# Altium project ek-ra8d2_mp - Customer.PrjPcb (part 1 of 5)
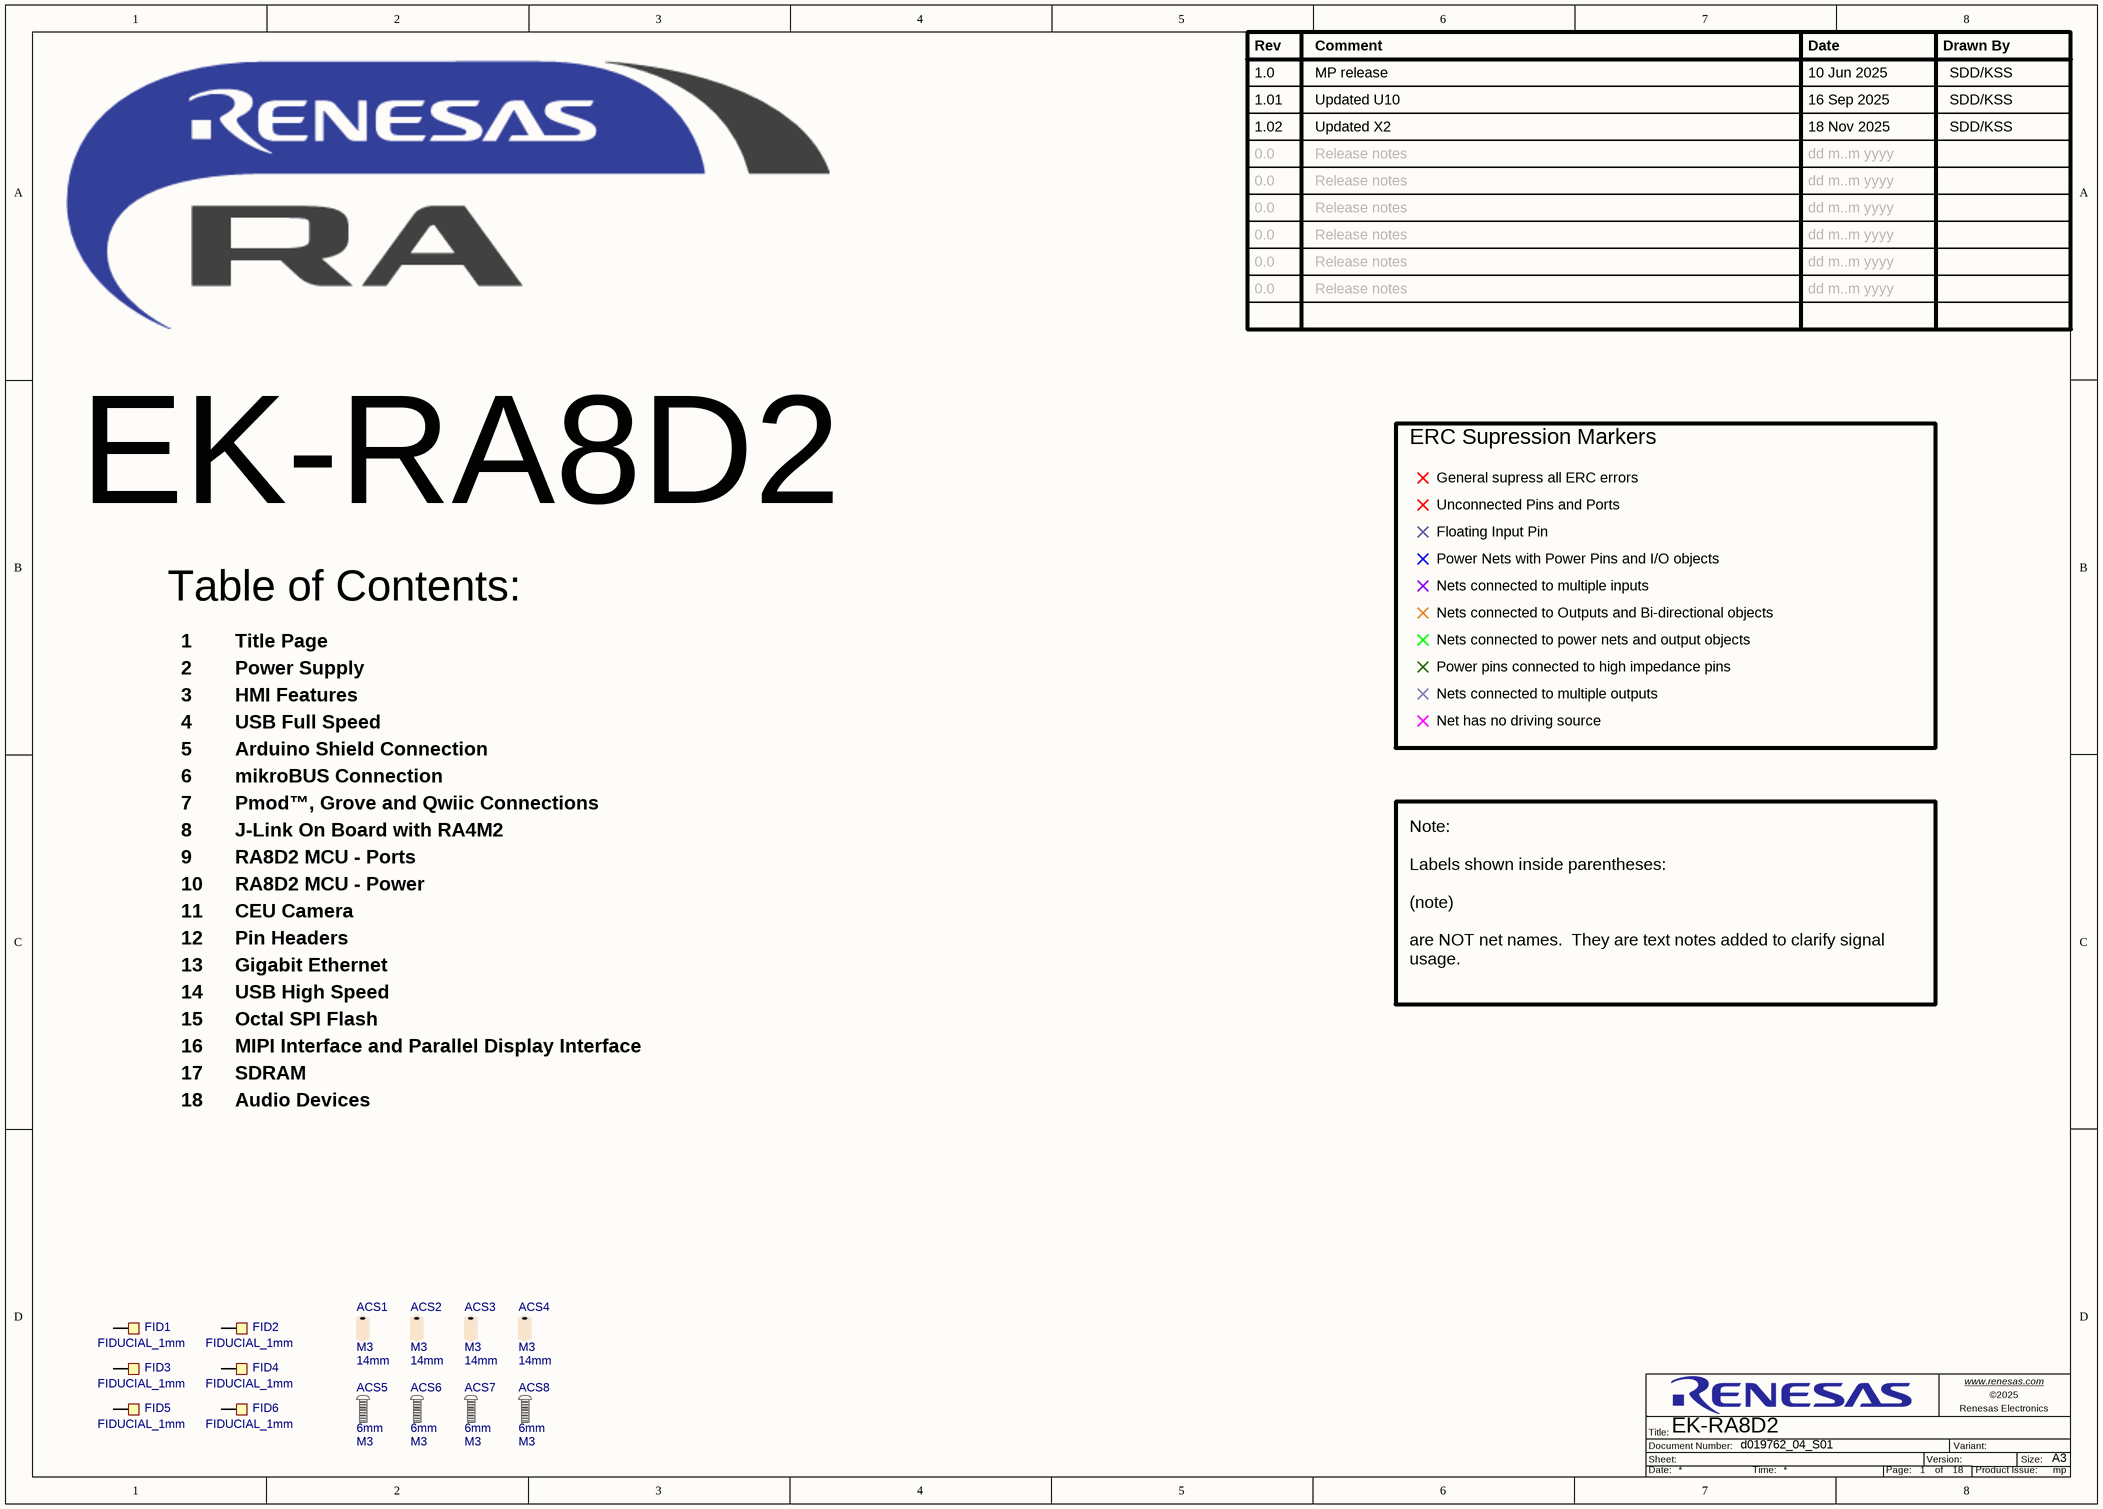
[diagram p0: Title Page.SchDoc]
Version: 0101; VariantNumber: 0; ReleaseState: mp; ReleaseDate: 16.09.2025; ProductName: EK-RA8D2; PCBARevision: 0100; Kitversion: 1; KitReleaseStage: mp; KitNameTop: EK RA8D2; KitName: EK-RA8D2; DNumberBase: d019762; DNumber: d019762; Date: 2025; .KitNameBottom: EK-RA8D2
18 sheets, 539 parts. Net scope: global (net labels, ports and power ports of the same name join across sheets).
Board file: ek_ra8d2.PcbDoc
Sheets:
  Title Page.SchDoc
  Power Supply.SchDoc
  HMI Features.SchDoc
  USB Full Speed.SchDoc
  Arduino Shield Connection.SchDoc
  mikroBUS Connection.SchDoc
  Pmod, Grove and Qwiic Connections.SchDoc
  J-Link On Board with RA4M2.SchDoc
  RA8D2 MCU - Ports.SchDoc
  RA8D2 MCU - Power.SchDoc
  CEU Camera.SchDoc
  Pin Headers.SchDoc
  Gigabit Ethernet.SchDoc
  USB High Speed.SchDoc
  Octal SPI Flash.SchDoc
  MIPI Interface and Parallel Display Interface.SchDoc
  SDRAM.SchDoc
  Audio Devices.SchDoc

## Sheet Title Page.SchDoc
size A3; Company Name: Renesas Electronics America; CompanyURL: www.renesas.com; PageSetup: Record=PageOptions|CenterHorizontal=True|CenterVertical=True|PrintScale=1.00|XCorrection=1.00|YCorrection=1.00|PrintKind=1|BorderSize=5000000|LeftOffset=0|BottomOffset=0|Orientation=2|PaperLength=1000|PaperWidth=1000|Scale=100|PaperSource=7|PrintQuality=-4|MediaType=1|DitherType=10|PaperKind=A5 148x210mm|PrintScaleMode=1; ReleaseDate: 16.09.2025; Version: MP; SheetNumber: 1; SheetTotal: 18; VariantNumber: 0; DSheetNumber: 1

### Parts
ACS1  Thread: M3  Length: 14mm  [standoff_6p0_M3x14x0p5_HexFemale]  (hidden comment: MTS-14)
ACS2  Thread: M3  Length: 14mm  [standoff_6p0_M3x14x0p5_HexFemale]  (hidden comment: MTS-14)
ACS3  Thread: M3  Length: 14mm  [standoff_6p0_M3x14x0p5_HexFemale]  (hidden comment: MTS-14)
ACS4  Thread: M3  Length: 14mm  [standoff_6p0_M3x14x0p5_HexFemale]  (hidden comment: MTS-14)
ACS5  Length: 6mm  Thread: M3  [screw_M3x0p5,6mm]  (hidden comment: 50M030050P006)
ACS6  Length: 6mm  Thread: M3  [screw_M3x0p5,6mm]  (hidden comment: 50M030050P006)
ACS7  Length: 6mm  Thread: M3  [screw_M3x0p5,6mm]  (hidden comment: 50M030050P006)
ACS8  Length: 6mm  Thread: M3  [screw_M3x0p5,6mm]  (hidden comment: 50M030050P006)
FID1  FIDUCIAL_1mm  [Fiducial_1mm]  (no BOM)
FID2  FIDUCIAL_1mm  [Fiducial_1mm]  (no BOM)
FID3  FIDUCIAL_1mm  [Fiducial_1mm]  (no BOM)
FID4  FIDUCIAL_1mm  [Fiducial_1mm]  (no BOM)
FID5  FIDUCIAL_1mm  [Fiducial_1mm]  (no BOM)
FID6  FIDUCIAL_1mm  [Fiducial_1mm]  (no BOM)

### Nets

Not connected (* = marked no-connect by the designer): FID1 1; FID2 1; FID3 1; FID4 1; FID5 1; FID6 1

### Notes on the sheet
- Rev
- Comment
- Date
- Drawn By
- 1.0
- 1.01
- MP release
- Updated U10
- 10 Jun 2025
- 16 Sep 2025
- SDD/KSS
- 0.0
- 1.02
- Release notes
- Updated X2
- dd m..m yyyy
- 18 Nov 2025
- ERC Supression Markers
- General supress all ERC errors
- Unconnected Pins and Ports
- Table of Contents:
- Floating Input Pin
- Power Nets with Power Pins and I/O objects
- Nets connected to multiple inputs
- 1
- Title Page
- Nets connected to Outputs and Bi-directional objects
- Nets connected to power nets and output objects
- 2
- 3
- Power Supply
- HMI Features
- Power pins connected to high impedance pins
- Nets connected to multiple outputs
- Net has no driving source
- 4
- 5
- 6
- USB Full Speed
- Arduino Shield Connection
- mikroBUS Connection
- 7
- 8
- Pmod™, Grove and Qwiic Connections
- J-Link On Board with RA4M2
- 9
- 10
- 11
- RA8D2 MCU - Ports
- RA8D2 MCU - Power
- CEU Camera
- 12
- 13
- Pin Headers
- Gigabit Ethernet
- 14
- 15
- 16
- USB High Speed
- Octal SPI Flash
- MIPI Interface and Parallel Display Interface
- Note:
  Labels shown inside parentheses:
  (note)
  are NOT net names.  They are text notes added to clarify signal usage.
- 17
- 18
- SDRAM
- Audio Devices
- www.renesas.com <http://www.renesas.com>
- Sheet:
- Title:
- Document Number:
- Version:
- Variant:
- Renesas Electronics
- Size:
- A3
- Date:
- Time:
- Page:
- of
- Product Issue:

### Library data of the parts
ACS1-ACS4 = ACS-00000000-5: Female Standoff; Nylon; Natural; M3; 14.0 mm Spacer; Width: 6mm; Subtype: Spacer; Material: Nylon Black
ACS5-ACS8 = ACS-00000005-4: Pan Phillips Screw, M3x0p5, Length 6mm, Natural, Nylon; Subtype: Screw; Material: Nylon Transparent
FID1-FID6 = MIS-00000006-3: Fiducial, 1mm, 0.5mm soldermask; Subtype: Testpoint; Value: TP; Qualification: -; Pin Count: 1

## Sheet Power Supply.SchDoc
size A3; Company Name: Renesas Electronics America; CompanyURL: www.renesas.com; PageSetup: Record=PageOptions|CenterHorizontal=True|CenterVertical=True|PrintScale=1.00|XCorrection=1.00|YCorrection=1.00|PrintKind=1|BorderSize=5000000|LeftOffset=0|BottomOffset=0|Orientation=2|PaperLength=1000|PaperWidth=1000|Scale=100|PaperSource=7|PrintQuality=-4|MediaType=1|DitherType=10|PaperKind=A5 148x210mm|PrintScaleMode=1; ReleaseDate: 16.09.2025; Version: MP; SheetNumber: 2; SheetTotal: 18; VariantNumber: 0; DSheetNumber: 1
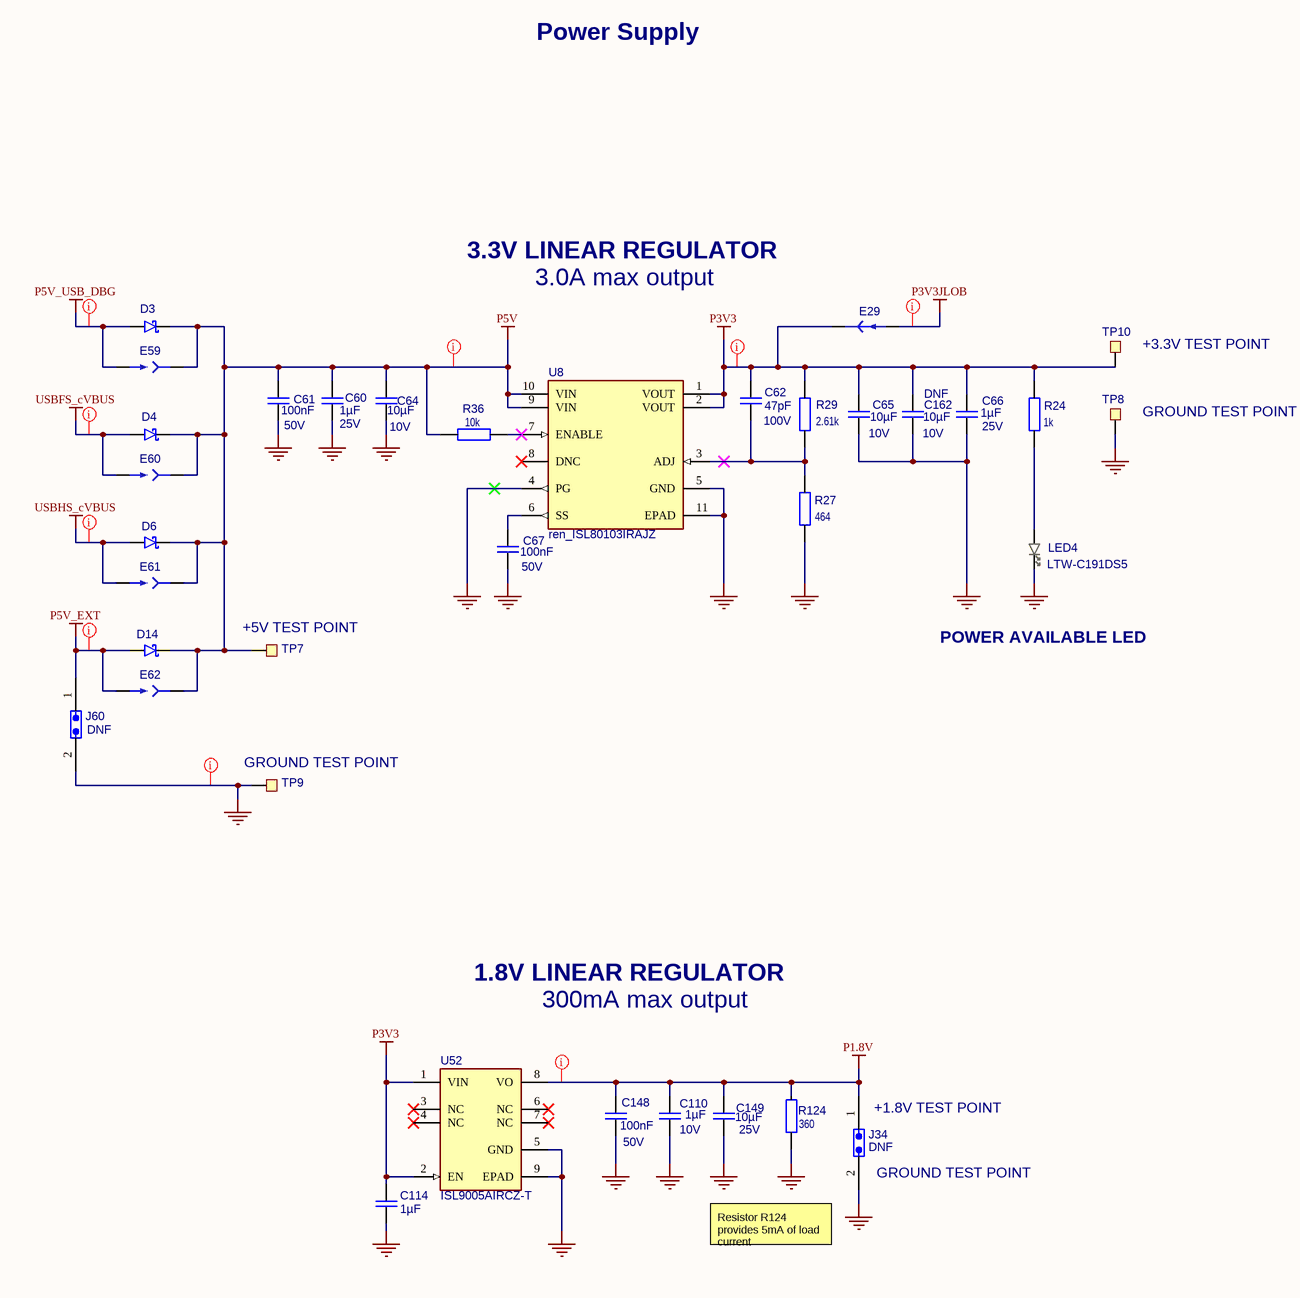
[diagram p1: Power Supply.SchDoc]

### Parts
C60  value 1µF  Operating Voltage Max: 25V  [C_EIA0402_0p6]  (hidden comment: Capacitor)
C61  value 100nF  Operating Voltage Max: 50V  [C_EIA0402_0p55]  (hidden comment: Capacitor)
C62  value 47pF  Operating Voltage Max: 100V  [C_EIA0402_0p55]  (hidden comment: Capacitor)
C64  value 10µF  Operating Voltage Max: 10V  [C_EIA0402_0p7]  (hidden comment: Capacitor)
C65  value 10µF  Operating Voltage Max: 10V  [C_EIA0402_0p7]  (hidden comment: Capacitor)
C66  value 1µF  Operating Voltage Max: 25V  [C_EIA0402_0p6]  (hidden comment: Capacitor)
C67  value 100nF  Operating Voltage Max: 50V  [C_EIA0402_0p55]  (hidden comment: Capacitor)
C110  value 1µF  Operating Voltage Max: 25V  [C_EIA0402_0p6]  (hidden comment: Capacitor)
C114  value 1µF  [C_EIA0402_0p6]  (hidden comment: Capacitor)
C148  value 100nF  Operating Voltage Max: 50V  [C_EIA0402_0p55]  (hidden comment: Capacitor)
C149  value 10µF  Operating Voltage Max: 10V  [C_EIA0402_0p7]  (hidden comment: Capacitor)
C162  value 10µF  Operating Voltage Max: 10V  [C_EIA0402_0p7]  (hidden comment: Capacitor)
D3  B340AQ-13-F  [dio_SMA]  (value not drawn)
D4  B340AQ-13-F  [dio_SMA]  (value not drawn)
D6  B340AQ-13-F  [dio_SMA]  (value not drawn)
D14  B340AQ-13-F  [dio_SMA]  (value not drawn)
E29  TRACE_CUT_0805  [trace_cut_0805]  (value not drawn)  (net tie, no BOM)
E59  SOLDER_BRIDGE_0805  [solder_bridge_0805]  (value not drawn)  (no BOM)
E60  SOLDER_BRIDGE_0805  [solder_bridge_0805]  (value not drawn)  (no BOM)
E61  SOLDER_BRIDGE_0805  [solder_bridge_0805]  (value not drawn)  (no BOM)
E62  SOLDER_BRIDGE_0805  [solder_bridge_0805]  (value not drawn)  (no BOM)
J34  61300211121  [wue_61300211121]  (value not drawn)
J60  61300211121  [wue_61300211121]  (value not drawn)
LED4  LTW-C191DS5  [led_0603_w]
R24  value 1k  [R_EIA0402]  (hidden comment: RC0402FR-071KL)
R27  value 464  [R_EIA0603]  (hidden comment: Resistor)
R29  value 2.61k  [R_EIA0603]  (hidden comment: Resistor)
R36  value 10k  [R_EIA0402]  (hidden comment: Resistor)
R124  value 360  [R_EIA0402]  (hidden comment: Resistor)
TP7  TP_Mini  [key_5019]  (value not drawn)
TP8  TP_Mini  [key_5019]  (value not drawn)
TP9  TP_Mini  [key_5019]  (value not drawn)
TP10  TP_Mini  [key_5019]  (value not drawn)
U8  ren_ISL80103IRAJZ  [ren_tdfn10_L10.3X3]
U52  ISL9005AIRCZ-T  [ren_DFN-8_3.00x2.00mm]

### Nets
GND: C60.2 C61.1 C64.1 C65.1 C66.2 C67.1 C110.2 C114.2 C148.1 C149.1 C162.1 J34.2 J60.2 LED4.1(K) R27.1 R124.1 TP8.1 TP9.1 U8.4(PG) U8.5(GND) U8.11(EPAD) U52.5(GND) U52.9(EPAD)
P1.8V: C110.1 C148.2 C149.2 J34.1 R124.2 U52.8(VO)
P3V3: C62.1 C65.2 C66.1 C114.1 C162.2 E29.1 R24.2 R29.2 TP10.1 U8.1(VOUT) U8.2(VOUT) U52.1(VIN) U52.2(EN)
P3V3JLOB: E29.2
P5V: C60.1 C61.2 C64.2 D3.1(K) D4.1(K) D6.1(K) D14.1(K) E59.1 E60.1 E61.1 E62.1 R36.1 TP7.1 U8.9(VIN) U8.10(VIN)
P5V_EXT: D14.2(A) E62.2 J60.1
P5V_USB_DBG: D3.2(A) E59.2
USBFS_cVBUS: D4.2(A) E60.2
USBHS_cVBUS: D6.2(A) E61.2
NetC62_2: C62.2 R27.2 R29.1 U8.3(ADJ)
NetC67_2: C67.2 U8.6(SS)
NetLED4_2: LED4.2(A) R24.1
NetR36_2: R36.2 U8.7(ENABLE)

Not connected (* = marked no-connect by the designer): U8 8(DNC)*; U52 3(NC)* 4(NC)* 6(NC)* 7(NC)*

### Layout directives
net class Power; rule Supply Nets [Voltage = 5.000]: P5V, P5V_EXT, P5V_USB_DBG, USBFS_cVBUS, USBHS_cVBUS
net class Power; rule Supply Nets [Voltage = 3.300]: P3V3, P3V3JLOB
net class Power; rule Supply Nets [Voltage = 1.800]: P1.8V
net class Power; rule Supply Nets [Voltage = 0.000]: GND

### Notes on the sheet
- Power Supply
- 3.0A max output
- 3.3V LINEAR REGULATOR
- (near TP10) +3.3V TEST POINT
- (near TP8) GROUND TEST POINT
- (near TP7) +5V TEST POINT
- POWER AVAILABLE LED
- (near TP9) GROUND TEST POINT
- 300mA max output
- 1.8V LINEAR REGULATOR
- (near J34) +1.8V TEST POINT
- (near J34) GROUND TEST POINT
- Resistor R124 provides 5mA of load current
- www.renesas.com <http://www.renesas.com>
- Sheet:
- Title:
- Document Number:
- Version:
- Variant:
- Renesas Electronics
- Size:
- A3
- Date:
- Time:
- Page:
- of
- Product Issue:

### Library data of the parts
C60 C66 C110 C114 = CAP-00000014-5: Capacitor,EIA0402,1u,25V,X6S; Tolerance: 10%; Qualification: AEC-Q200; Subtype: MLCC; Dielectric: X6S; Height: 600µm; Operating Temperature Max: 105°C; Operating Temperature Min: -55°C
  C114: Operating Voltage Max: 25V
C61 C67 C148 = CAP-00003203-9: Capacitor,EIA0402,100n,50V,X7R; Tolerance: 10%; Qualification: AEC-Q200; Subtype: MLCC; Dielectric: X7R; Height: 550µm; Operating Temperature Max: 125°C; Operating Temperature Min: -55°C
C62 = CAP-00003209-9: Capacitor,EIA0402,47p,100V,C0G; Tolerance: 5%; Qualification: AEC-Q200; Subtype: MLCC; Dielectric: C0G; Height: 550µm; Operating Temperature Max: 125°C; Operating Temperature Min: -55°C
C64 C65 C149 C162 = CAP-00003447-8: Capacitor,EIA0402,10u,10V,X5R; Tolerance: 20%; Subtype: MLCC; Dielectric: X5R; Height: 700µm; Operating Temperature Max: 85°C; Operating Temperature Min: -55°C; Qualification: -
  C162: DNF: DNF
D3 D4 D6 D14 = DIO-00000007-5: Rectifier Diode, Schottky, 1 Phase, 1 Element, 3A, 40V V(RRM), Silicon; Forward Voltage: 500mV; Power: 850mW; Qualification: AEC-Q101; Subtype: Schottky; Height: 2.4mm; Operating Temperature Min: -55°C; Reverse Voltage: 40V; Operating Temperature Max: 150°C; Current: 3A
E29 = MIS-00000000-11: Trace Cut, SMD, 0805 size; Value: TC; Pin Count: 2; Qualification: -; Subtype: Trace Cut
E59-E62 = MIS-00000002-7: Solder Bridge, SMD, 0805 size; Value: SB; Subtype: Solder Bridge; Qualification: -; Pin Count: 2
J34 J60 = CON-00003283-14: Header,2way,1row,vertical,2.54mm,THT; Gender: male; Current: 3A; DC Resistance: 20m; Operating Voltage Max: 250V; Height: 8.89mm; Operating Temperature Min: -40°C; Operating Temperature Max: 105°C; Qualification: -; Pin Count: 2; DNF: DNF
LED4 = DIO-00000002-6: Standard LEDs, SMD Ultra Bright White; Current: 5mA; Forward Voltage: 3.15V; Power: 72mW; Reverse Voltage: 5V; Subtype: LED; Height: 550µm; Operating Temperature Max: 85°C; Operating Temperature Min: -30°C; Qualification: -
R24 = RES-00000878-9: Resistor,EIA0402,1k,0.0625W; Power: 62.5mW; Tolerance: 1%; Subtype: Chip Resistor; Operating Temperature Max: 155°C; Operating Temperature Min: -55°C; Qualification: -
R27 = RES-00002182-11: Resistor,EIA0603,464,0.1W; Power: 100mW; Tolerance: 1%; Subtype: Chip Resistor; Operating Temperature Max: 155°C; Operating Temperature Min: -55°C; Qualification: -
R29 = RES-00002248-11: Resistor,EIA0603,2.61k,0.1W; Power: 100mW; Tolerance: 1%; Subtype: Chip Resistor; Operating Temperature Max: 155°C; Operating Temperature Min: -55°C; Qualification: -
R36 = RES-00000902-9: Resistor,EIA0402,10k,0.0625W; Power: 62.5mW; Tolerance: 1%; Subtype: Chip Resistor; Operating Temperature Max: 155°C; Operating Temperature Min: -55°C; Qualification: -
R124 = RES-00000867-9: Resistor,EIA0402,360,0.0625W; Power: 62.5mW; Tolerance: 1%; Subtype: Chip Resistor; Operating Temperature Max: 155°C; Operating Temperature Min: -55°C; Qualification: -
TP7-TP10 = MIS-00003478-10: Testpoint Miniature; Value: TP; Pin Count: 1; Qualification: -; Subtype: Testpoint
U8 = ICS-00000014-3: High Performance 3A Linear Regulator; Operating Voltage Max: 6V; Operating Voltage Min: 2.2V; Output Voltage Max: 5.5V; Output Voltage Min: 800mV; Subtype: Power; Current: 3A; Operating Temperature Max: 125°C; Operating Temperature Min: -40°C; Pin Count: 10; Qualification: -
U52 = ICS-00000140-2: LDO with Low ISUPPLY, High PSRR 1.8V fixed, 300mA; Subtype: Power; Operating Voltage Max: 6.5V; Operating Voltage Min: 2.3V; Current: 300mA; Operating Temperature Max: 85°C; Pin Count: 9; Qualification: -; Operating Temperature Min: -40°C; Output Voltage Max: 1.8V; Output Voltage Min: 1.8V

## Sheet HMI Features.SchDoc
size A3; Company Name: Renesas Electronics America; CompanyURL: www.renesas.com; PageSetup: Record=PageOptions|CenterHorizontal=True|CenterVertical=True|PrintScale=1.00|XCorrection=1.00|YCorrection=1.00|PrintKind=1|BorderSize=5000000|LeftOffset=0|BottomOffset=0|Orientation=2|PaperLength=1000|PaperWidth=1000|Scale=100|PaperSource=7|PrintQuality=-4|MediaType=1|DitherType=10|PaperKind=A5 148x210mm|PrintScaleMode=1; ReleaseDate: 16.09.2025; Version: MP; SheetNumber: 3; SheetTotal: 18; VariantNumber: 0; DSheetNumber: 1
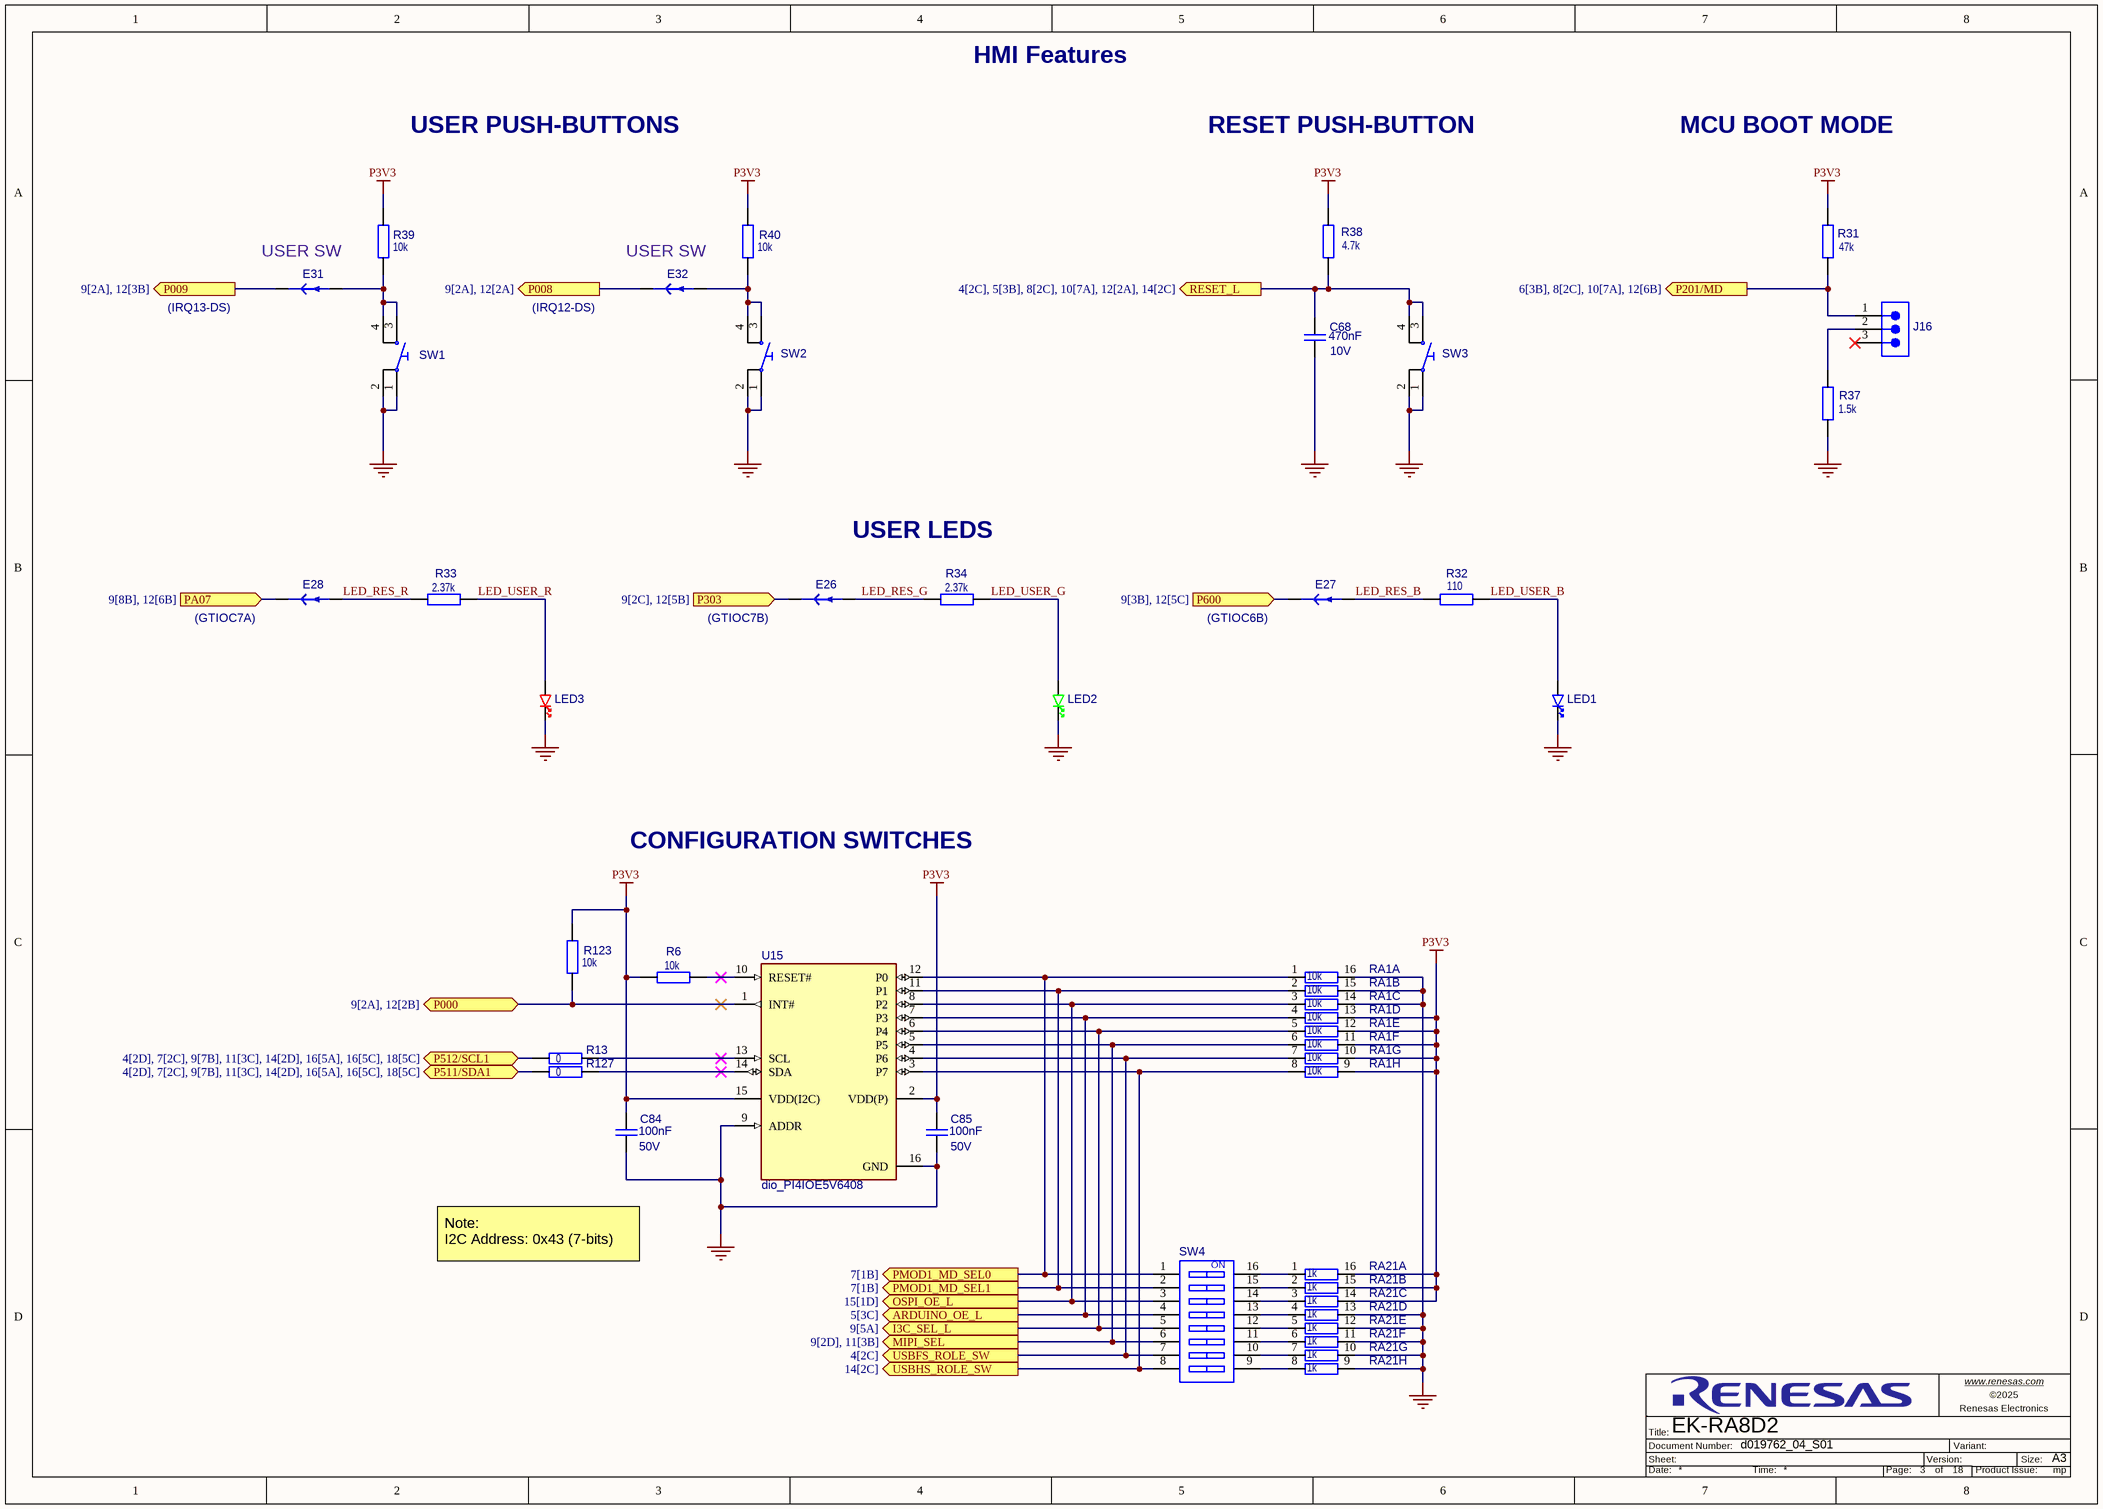
[diagram p2: HMI Features.SchDoc]

### Parts
C68  value 470nF  Operating Voltage Max: 10V  [C_EIA0402_0p55]  (hidden comment: Capacitor)
C84  value 100nF  Operating Voltage Max: 50V  [C_EIA0402_0p55]  (hidden comment: Capacitor)
C85  value 100nF  Operating Voltage Max: 50V  [C_EIA0402_0p55]  (hidden comment: Capacitor)
E26  TRACE_CUT_0805  [trace_cut_0805]  (value not drawn)  (net tie, no BOM)
E27  TRACE_CUT_0805  [trace_cut_0805]  (value not drawn)  (net tie, no BOM)
E28  TRACE_CUT_0805  [trace_cut_0805]  (value not drawn)  (net tie, no BOM)
E31  TRACE_CUT_0805  [trace_cut_0805]  (value not drawn)  (net tie, no BOM)
E32  TRACE_CUT_0805  [trace_cut_0805]  (value not drawn)  (net tie, no BOM)
J16  2842102-3  [tec_2842102-3]  (value not drawn)
LED1  150060BS75000  [led_0603_b]  (value not drawn)
LED2  150060GS75000  [led_0603_g]  (value not drawn)
LED3  150060RS75000  [led_0603_r]  (value not drawn)
R6  value 10k  [R_EIA0402]  (hidden comment: Resistor)
R13  value 0  [R_EIA0402]  (hidden comment: Resistor)
R31  value 47k  [R_EIA0402]  (hidden comment: Resistor)
R32  value 110  [R_EIA0402]  (hidden comment: Resistor)
R33  value 2.37k  [R_EIA0402]  (hidden comment: Resistor)
R34  value 2.37k  [R_EIA0402]  (hidden comment: Resistor)
R37  value 1.5k  [R_EIA0402]  (hidden comment: RC0402FR-071K5L)
R38  value 4.7k  [R_EIA0402]  (hidden comment: Resistor)
R39  value 10k  [R_EIA0402]  (hidden comment: Resistor)
R40  value 10k  [R_EIA0402]  (hidden comment: Resistor)
R123  value 10k  [R_EIA0402]  (hidden comment: Resistor)
R127  value 0  [R_EIA0402]  (hidden comment: Resistor)
RA1  value 10k  [R_Array_EIA1506]  (hidden comment: EXB-2HV103JV)  (parts A,B,C,D,E,F,G,H of 8)
RA21  value 1k  [R_Array_EIA1506]  (hidden comment: EXB-2HV102JV)  (parts A,B,C,D,E,F,G,H of 8)
SW1  PTS645SM43SMTR92LFS  [ck_PTS645_g_smt_4p3]  (value not drawn)
SW2  PTS645SM43SMTR92LFS  [ck_PTS645_g_smt_4p3]  (value not drawn)
SW3  PTS645SK43SMTR92LFS  [ck_PTS645_g_smt_4p3_red]  (value not drawn)
SW4  416131160808  [wue_416131160808]  (value not drawn)
U15  dio_PI4IOE5V6408  [dio_uqfn-16_zta16]

### Ports
ARDUINO_OE_L (out, see 5[3C]), I3C_SEL_L (out, see 9[5A]), MIPI_SEL (out, see 9[2D], 11[3B]), OSPI_OE_L (out, see 15[1D]), P000 (bidir, see 9[2A], 12[2B]), P008 (out, see 9[2A], 12[2A]), P009 (out, see 9[2A], 12[3B]), P201/MD (out, see 6[3B], 8[2C], 10[7A], 12[6B]), P303 (in, see 9[2C], 12[5B]), P511/SDA1 (bidir, see 4[2D], 7[2C], 9[7B], 11[3C], 14[2D], 16[5A], 16[5C], 18[5C]), P512/SCL1 (bidir, see 4[2D], 7[2C], 9[7B], 11[3C], 14[2D], 16[5A], 16[5C], 18[5C]), P600 (in, see 9[3B], 12[5C]), PA07 (in, see 9[8B], 12[6B]), PMOD1_MD_SEL0 (out, see 7[1B]), PMOD1_MD_SEL1 (out, see 7[1B]), RESET_L (out, see 4[2C], 5[3B], 8[2C], 10[7A], 12[2A], 14[2C]), USBFS_ROLE_SW (out, see 4[2C]), USBHS_ROLE_SW (out, see 14[2C])

### Nets
GND: C68.1 C84.1 C85.1 LED1.1(K) LED2.1(K) LED3.1(K) R37.1 RA1.14 RA1.15 RA1.16 RA21.9 RA21.10 RA21.11 RA21.12 RA21.13 SW1.1 SW1.2 SW2.1 SW2.2 SW3.1 SW3.2 U15.9(ADDR) U15.16(GND)
P3V3: C84.2 C85.2 R6.2 R31.2 R38.2 R39.2 R40.2 R123.2 RA1.9 RA1.10 RA1.11 RA1.12 RA1.13 RA21.14 RA21.15 RA21.16 U15.2(VDD(P)) U15.15(VDD(I2C))
ARDUINO_OE_L: RA1.4 SW4.4 U15.7(P3) ; port ARDUINO_OE_L
I3C_SEL_L: RA1.5 SW4.5 U15.6(P4) ; port I3C_SEL_L
LED_RES_B: E27.2 R32.1
LED_RES_G: E26.2 R34.1
LED_RES_R: E28.2 R33.1
LED_USER_B: LED1.2(A) R32.2
LED_USER_G: LED2.2(A) R34.2
LED_USER_R: LED3.2(A) R33.2
MIPI_SEL: RA1.6 SW4.6 U15.5(P5) ; port MIPI_SEL
OSPI_OE_L: RA1.3 SW4.3 U15.8(P2) ; port OSPI_OE_L
P000: R123.1 U15.1(INT#) ; port P000
P008: E32.1 ; port P008
P009: E31.1 ; port P009
P201/MD: J16.1 R31.1 ; port P201/MD
P303: E26.1 ; port P303
P511/SDA1: R127.2 ; port P511/SDA1
P512/SCL1: R13.2 ; port P512/SCL1
P600: E27.1 ; port P600
PA07: E28.1 ; port PA07
PMOD1_MD_SEL0: RA1.1 SW4.1 U15.12(P0) ; port PMOD1_MD_SEL0
PMOD1_MD_SEL1: RA1.2 SW4.2 U15.11(P1) ; port PMOD1_MD_SEL1
RESET_L: C68.2 R38.1 SW3.3 SW3.4 ; port RESET_L
USBFS_ROLE_SW: RA1.7 SW4.7 U15.4(P6) ; port USBFS_ROLE_SW
USBHS_ROLE_SW: RA1.8 SW4.8 U15.3(P7) ; port USBHS_ROLE_SW
NetE31_2: E31.2 R39.1 SW1.3 SW1.4
NetE32_2: E32.2 R40.1 SW2.3 SW2.4
NetJ16_2: J16.2 R37.2
NetR6_1: R6.1 U15.10(RESET#)
NetR13_1: R13.1 U15.13(SCL)
NetR127_1: R127.1 U15.14(SDA)
NetRA21_1: RA21.1 SW4.16
NetRA21_2: RA21.2 SW4.15
NetRA21_3: RA21.3 SW4.14
NetRA21_4: RA21.4 SW4.13
NetRA21_5: RA21.5 SW4.12
NetRA21_6: RA21.6 SW4.11
NetRA21_7: RA21.7 SW4.10
NetRA21_8: RA21.8 SW4.9

Not connected (* = marked no-connect by the designer): J16 3*

### Notes on the sheet
- HMI Features
- USER PUSH-BUTTONS
- RESET PUSH-BUTTON
- MCU BOOT MODE
- (IRQ13-DS)
- (near E31) USER SW
- (IRQ12-DS)
- (near E32) USER SW
- USER LEDS
- (near E28) (GTIOC7A)
- (near E26) (GTIOC7B)
- (near E27) (GTIOC6B)
- CONFIGURATION SWITCHES
- Note:
  I2C Address: 0x43 (7-bits)
- www.renesas.com <http://www.renesas.com>
- Sheet:
- Title:
- Document Number:
- Version:
- Variant:
- Renesas Electronics
- Size:
- A3
- Date:
- Time:
- Page:
- of
- Product Issue:
- (in symbol MEC-00003402-14) ON

### Library data of the parts
C68 = CAP-00003217-9: Capacitor,EIA0402,470n,10V,X7R; Tolerance: 10%; Qualification: AEC-Q200; Subtype: MLCC; Dielectric: X7R; Height: 550µm; Operating Temperature Max: 125°C; Operating Temperature Min: -55°C
C84 C85 = CAP-00003203-9: as C61 on sheet Power Supply; Dielectric: X7R; Height: 550µm; Operating Temperature Max: 125°C; Operating Temperature Min: -55°C
E26-E28 E31 E32 = MIS-00000000-11: Trace Cut, SMD, 0805 size; Value: TC; Pin Count: 2; Qualification: -; Subtype: Trace Cut
J16 = CON-00000097-5: Header, 3way, 1row, vertical, 2.00mm, SMD; Gender: male; Current: 2A; Operating Voltage Max: 125V; Operating Temperature Max: 125°C; Pin Count: 3; Height: 6.55mm; Qualification: -; Operating Temperature Min: -40°C
LED1 = DIO-00000012-5: Standard LEDs - SMD Blue, 470nm 90 to 145 mcd; Reverse Voltage: 5V; Current: 30mA; Subtype: LED; Forward Voltage: 3.2V; Qualification: -; Height: 800µm; Operating Temperature Max: 85°C; Operating Temperature Min: -40°C
LED2 = DIO-00000013-5: Standard LEDs - SMD Green, 525nm 220 to 430 mcd; Subtype: LED; Forward Voltage: 3.2V; Current: 30mA; Reverse Voltage: 5V; Operating Temperature Min: -40°C; Operating Temperature Max: 85°C; Height: 800µm; Qualification: -
LED3 = DIO-00000014-5: Standard LEDs - SMD Red, 625nm 120 to 250 mcd; Reverse Voltage: 5V; Current: 30mA; Subtype: LED; Forward Voltage: 2V; Operating Temperature Min: -40°C; Qualification: -; Height: 800µm; Operating Temperature Max: 85°C
R6 R39 R40 R123 = RES-00000902-9: as R36 on sheet Power Supply; Operating Temperature Max: 155°C; Operating Temperature Min: -55°C; Qualification: -
R13 R127 = RES-00000801-9: Resistor,EIA0402,0,0.0625W; Power: 62.5mW; Tolerance: 5%; Subtype: Chip Resistor; Operating Temperature Max: 155°C; Operating Temperature Min: -55°C; Qualification: -
R31 = RES-00000918-9: Resistor,EIA0402,47k,0.0625W; Power: 62.5mW; Tolerance: 1%; Subtype: Chip Resistor; Operating Temperature Max: 155°C; Operating Temperature Min: -55°C; Qualification: -
R32 = RES-00000855-9: Resistor,EIA0402,110,0.0625W; Power: 62.5mW; Tolerance: 1%; Subtype: Chip Resistor; Operating Temperature Max: 155°C; Operating Temperature Min: -55°C; Qualification: -
R33 R34 = RES-00001614-10: Resistor,EIA0402,2.37k,0.0625W; Power: 62.5mW; Tolerance: 1%; Subtype: Chip Resistor; Operating Temperature Max: 155°C; Operating Temperature Min: -55°C; Qualification: -
R37 = RES-00000882-9: Resistor,EIA0402,1.5k,0.0625W; Power: 62.5mW; Tolerance: 1%; Subtype: Chip Resistor; Operating Temperature Max: 155°C; Operating Temperature Min: -55°C; Qualification: -
R38 = RES-00000894-9: Resistor,EIA0402,4.7k,0.0625W; Power: 62.5mW; Tolerance: 1%; Subtype: Chip Resistor; Operating Temperature Max: 155°C; Operating Temperature Min: -55°C; Qualification: -
RA1 = RES-00003208-7: Resistor Network & Array,EIA1506,10k,0.063W; Subtype: Resistor Array; Qualification: AEC-Q200; Operating Voltage Max: 50V; Tolerance: 5%; Power: 62.5mW; Operating Temperature Min: -55°C; Height: 550µm; Operating Temperature Max: 125°C
RA21 = RES-00003215-4: Array/Network Resistor, Isolated, Metal Glaze/thick Film, 0.063W, 1000ohm, 25V, 5% +/-Tol, 200ppm/Cel, Surface Mount, 1506; Power: 63mW; Qualification: AEC-Q200; Temperature Coefficient: 200ppm; Subtype: Resistor Array; Height: 550µm; Operating Voltage Max: 25V; Tolerance: 5%; Operating Temperature Max: 125°C; Operating Temperature Min: -55°C
SW1 SW2 = MEC-00000002-3: SMD Push Button Switch, 4-pin, 6x6mm, 4.3mm height, Blue Actuator; Current: 50mA; Operating Voltage Max: 12V; Subtype: Switch; Operating Temperature Min: -20°C; Operating Temperature Max: 60°C
SW3 = MEC-00000000-9: SMD Push Button Switch, 4-pin, 6x6mm, 4.3mm height,  Red Actuator; Current: 50mA; Operating Voltage Max: 12V; Operating Temperature Max: 85°C; Operating Temperature Min: -40°C; Subtype: Switch
SW4 = MEC-00003402-14: WS-DISV Small Compact SMT Flat Actuator with Top Tape 1.27 mm; Current: 100mA; Operating Voltage Max: 50V; Subtype: Switch; Operating Temperature Max: 85°C; Operating Temperature Min: -40°C
U15 = ICS-00000012-5: Low-voltage translating 8-bit I2C-bus I/O Expander; Current: 300µA; Operating Voltage Max: 4V; Operating Voltage Min: 1.65V; Output Voltage Min: 0V; Subtype: Digital; Operating Temperature Max: -40°C; Operating Temperature Min: 85°C; Output Voltage Max: 4V; Pin Count: 16; Qualification: -

## Sheet USB Full Speed.SchDoc
size A3; Company Name: Renesas Electronics America; CompanyURL: www.renesas.com; PageSetup: Record=PageOptions|CenterHorizontal=True|CenterVertical=True|PrintScale=1.00|XCorrection=1.00|YCorrection=1.00|PrintKind=1|BorderSize=5000000|LeftOffset=0|BottomOffset=0|Orientation=2|PaperLength=1000|PaperWidth=1000|Scale=100|PaperSource=7|PrintQuality=-4|MediaType=1|DitherType=10|PaperKind=A5 148x210mm|PrintScaleMode=1; ReleaseDate: 16.09.2025; Version: MP; SPICEModelCache: <root> / <DocumentId>FGGANMHQ</DocumentId> / </root>; SheetNumber: 4; SheetTotal: 18; VariantNumber: 0; DSheetNumber: 1
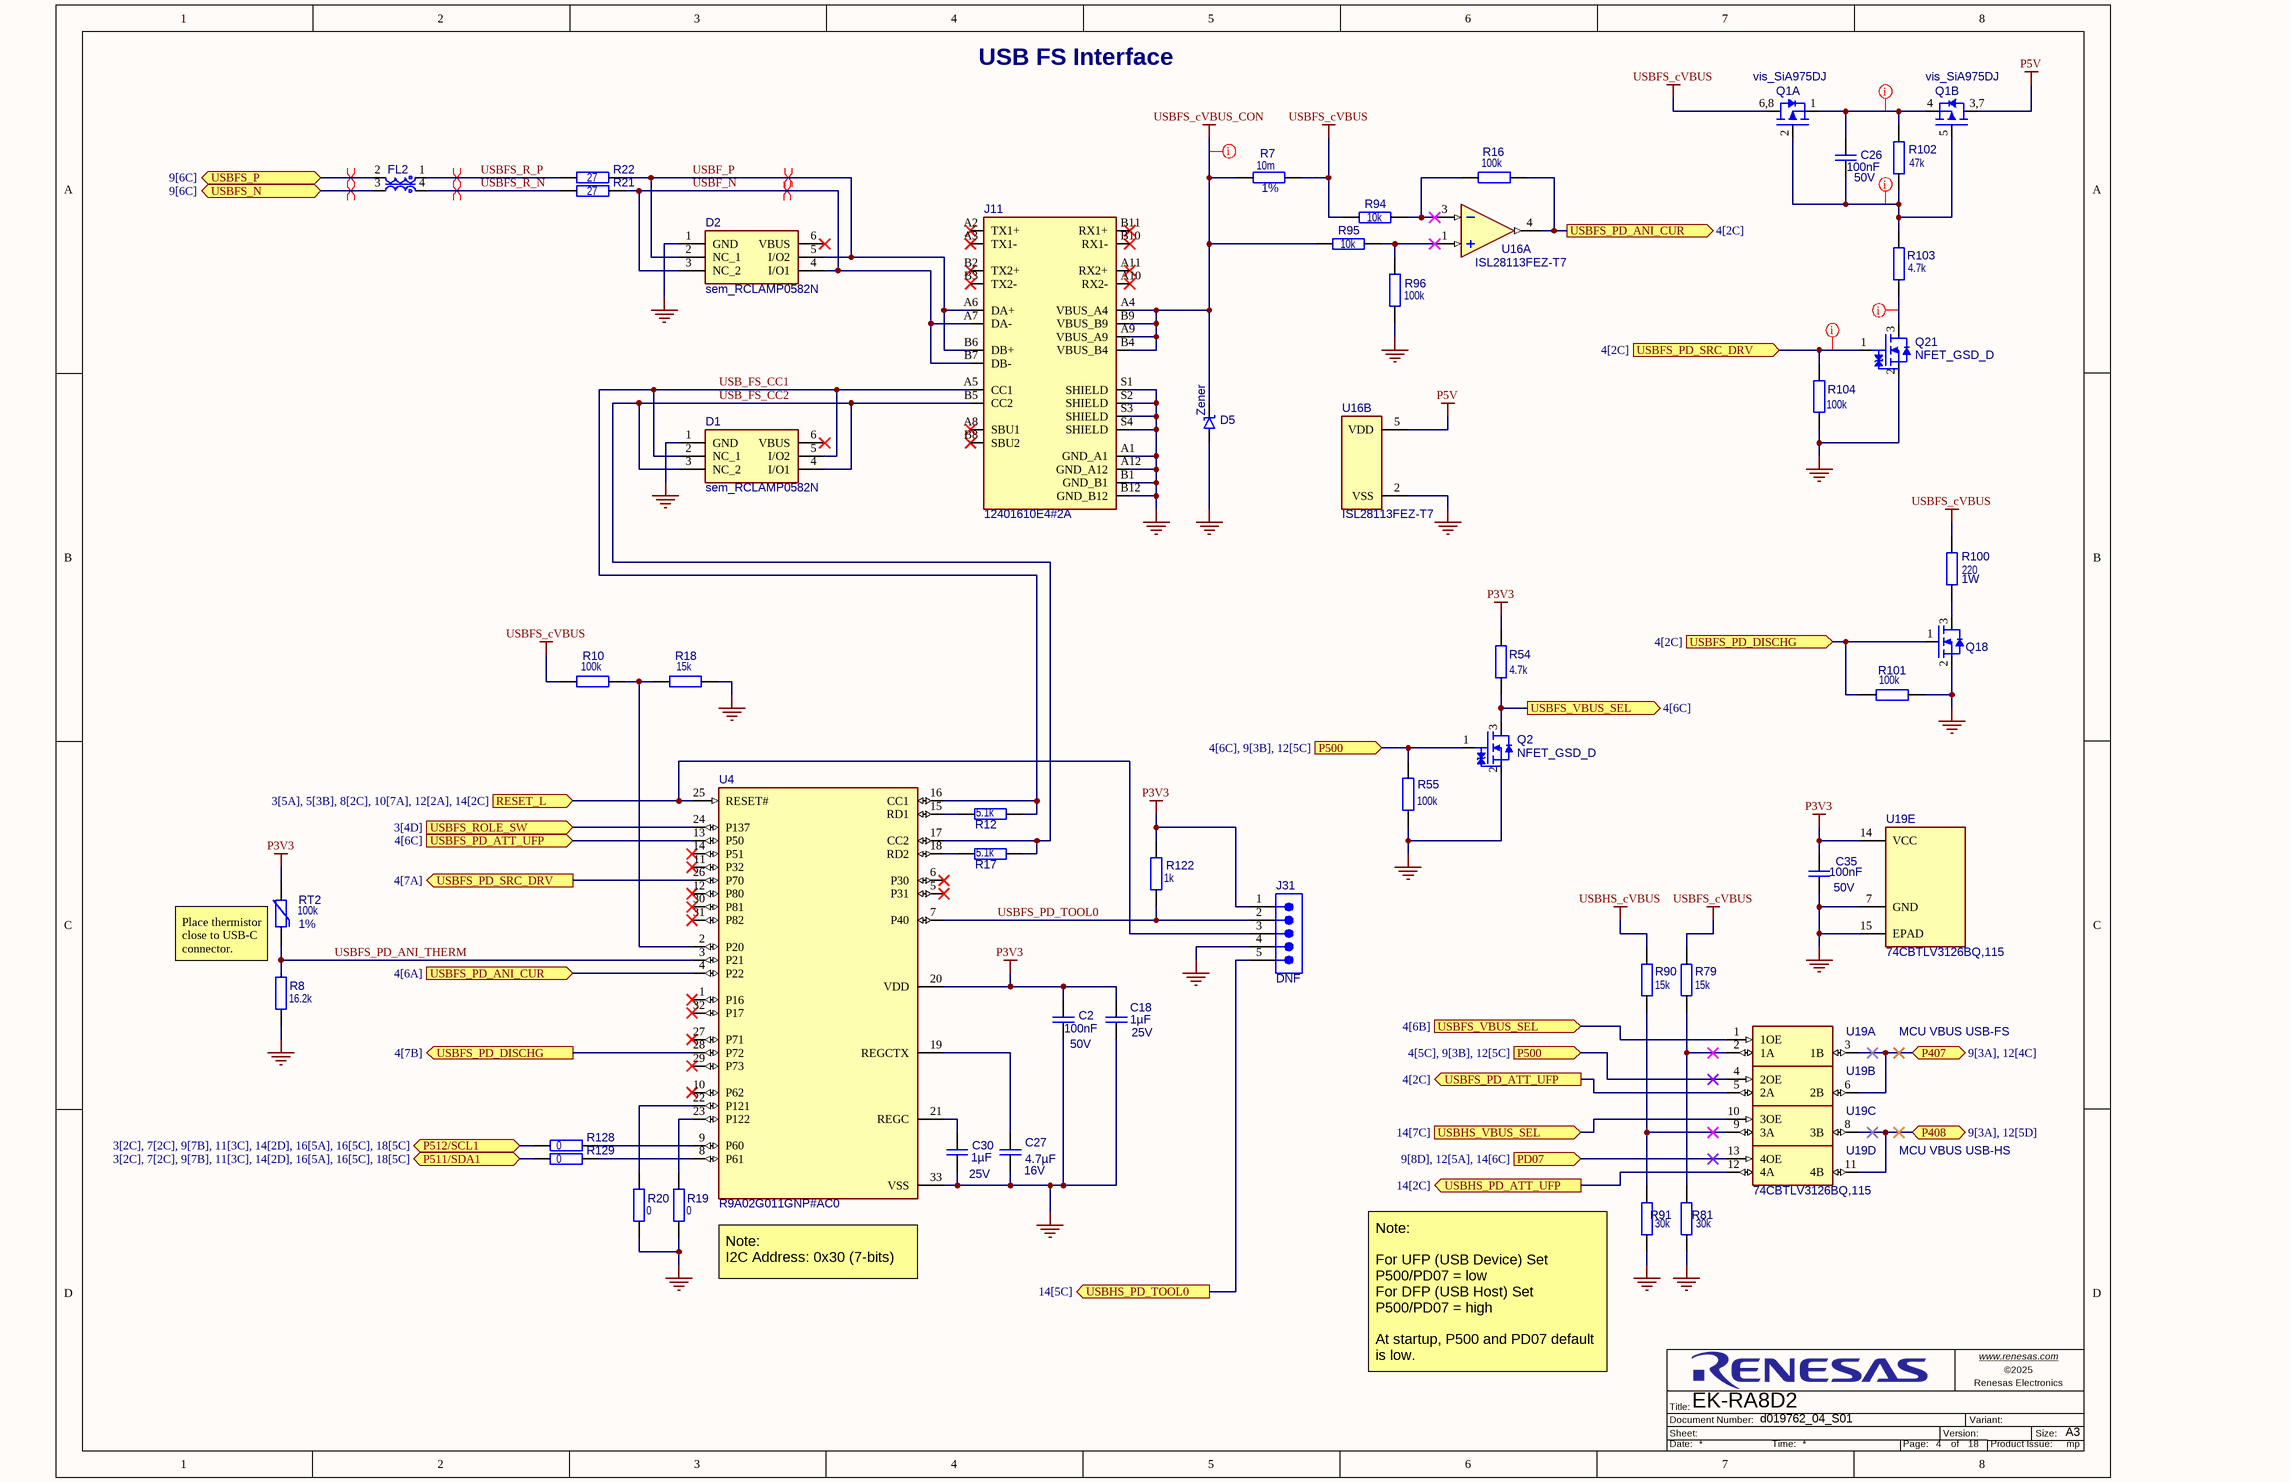
[diagram p3: USB Full Speed.SchDoc]

### Parts
C2  value 100nF  Operating Voltage Max: 50V  [C_EIA0402_0p55]  (hidden comment: Capacitor)
C18  value 1µF  Operating Voltage Max: 25V  [C_EIA0402_0p6]  (hidden comment: Capacitor)
C26  value 100nF  Operating Voltage Max: 50V  [C_EIA0402_0p55]  (hidden comment: Capacitor)
C27  value 4.7µF  Operating Voltage Max: 16V  [C_EIA0603_1p0]  (hidden comment: Capacitor)
C30  value 1µF  Operating Voltage Max: 25V  [C_EIA0402_0p6]  (hidden comment: Capacitor)
C35  value 100nF  Operating Voltage Max: 50V  [C_EIA0402_0p55]  (hidden comment: Capacitor)
D1  sem_RCLAMP0582N  [sem_SLP-6_SLP1210N6]
D2  sem_RCLAMP0582N  [sem_SLP-6_SLP1210N6]
D5  Zener  [sem_SGP-2_SGP1610N2]
FL2  CMC_1-2_4-3  [mur_EIA03025]  (value not drawn)
J11  12401610E4#2A  [amp_12401610E42A]
J31  CON_005  [wue_61300511121]  (value not drawn)
Q1  vis_SiA975DJ  [vis_SC70-6L_Dual]  (parts A,B of 2)
Q2  NFET_GSD_D  [roh_SOT-416FL_SC-89]
Q18  NFET_GSD  [ir_sot-23_3N]  (value not drawn)
Q21  NFET_GSD_D  [roh_SOT-416FL_SC-89]
R7  value 10m  Tolerance: 1%  [R_EIA0603]  (hidden comment: Resistor)
R8  value 16.2k  [R_EIA0402]  (hidden comment: Resistor)
R10  value 100k  [R_EIA0402]  (hidden comment: Resistor)
R12  value 5.1k  [R_EIA0402]  (hidden comment: Resistor)
R16  value 100k  [R_EIA0402]  (hidden comment: Resistor)
R17  value 5.1k  [R_EIA0402]  (hidden comment: Resistor)
R18  value 15k  [R_EIA0402]  (hidden comment: RC0402FR-0715KL)
R19  value 0  [R_EIA0402]  (hidden comment: Resistor)
R20  value 0  [R_EIA0402]  (hidden comment: Resistor)
R21  value 27  [R_EIA0402]  (hidden comment: Resistor)
R22  value 27  [R_EIA0402]  (hidden comment: Resistor)
R54  value 4.7k  [R_EIA0402]  (hidden comment: Resistor)
R55  value 100k  [R_EIA0402]  (hidden comment: Resistor)
R79  value 15k  [R_EIA0402]  (hidden comment: RC0402FR-0715KL)
R81  value 30k  [R_EIA0402]  (hidden comment: RC0402FR-0730KL)
R90  value 15k  [R_EIA0402]  (hidden comment: RC0402FR-0715KL)
R91  value 30k  [R_EIA0402]  (hidden comment: RC0402FR-0730KL)
R94  value 10k  [R_EIA0402]  (hidden comment: Resistor)
R95  value 10k  [R_EIA0402]  (hidden comment: Resistor)
R96  value 100k  [R_EIA0402]  (hidden comment: Resistor)
R100  value 220  Power: 1W  [R_EIA2512]  (hidden comment: Resistor)
R101  value 100k  [R_EIA0402]  (hidden comment: Resistor)
R102  value 47k  [R_EIA0402]  (hidden comment: Resistor)
R103  value 4.7k  [R_EIA0402]  (hidden comment: Resistor)
R104  value 100k  [R_EIA0402]  (hidden comment: Resistor)
R122  value 1k  [R_EIA0402]  (hidden comment: Resistor)
R128  value 0  [R_EIA0402]  (hidden comment: Resistor)
R129  value 0  [R_EIA0402]  (hidden comment: Resistor)
RT2  value 100k  Tolerance: 1%  [R_EIA0402]  (hidden comment: Thermistor)
U4  R9A02G011GNP#AC0  [ren_HVQFN-32_PVQN0032KG-A]
U16  ISL28113FEZ-T7  [ren_SC70-5_P5.049]  (parts A,B of 2)
U19  74CBTLV3126BQ,115  [nex_DHVQFN14_SOT-762-1_MO-241]  (value not drawn)  (parts A,B,C,D,E of 5)

### Ports
P407 (bidir, see 9[3A], 12[4C]), P408 (bidir, see 9[3A], 12[5D]), P500 (in, see 4[5C], 9[3B], 12[5C]), P500 (in, see 4[6C], 9[3B], 12[5C]), P511/SDA1 (bidir, see 3[2C], 7[2C], 9[7B], 11[3C], 14[2D], 16[5A], 16[5C], 18[5C]), P512/SCL1 (bidir, see 3[2C], 7[2C], 9[7B], 11[3C], 14[2D], 16[5A], 16[5C], 18[5C]), PD07 (in, see 9[8D], 12[5A], 14[6C]), RESET_L (in, see 3[5A], 5[3B], 8[2C], 10[7A], 12[2A], 14[2C]), USBFS_N (bidir, see 9[6C]), USBFS_P (bidir, see 9[6C]), USBFS_PD_ANI_CUR (in, see 4[6A]), USBFS_PD_ANI_CUR (out, see 4[2C]), USBFS_PD_ATT_UFP (in, see 4[6C]), USBFS_PD_ATT_UFP (out, see 4[2C]), USBFS_PD_DISCHG (in, see 4[2C]), USBFS_PD_DISCHG (out, see 4[7B]), USBFS_PD_SRC_DRV (in, see 4[2C]), USBFS_PD_SRC_DRV (out, see 4[7A]), USBFS_ROLE_SW (in, see 3[4D]), USBFS_VBUS_SEL (in, see 4[6B]), USBFS_VBUS_SEL (out, see 4[6C]), USBHS_PD_ATT_UFP (out, see 14[2C]), USBHS_PD_TOOL0 (out, see 14[5C]), USBHS_VBUS_SEL (in, see 14[7C])

### Nets
GND: C2.1 C18.2 C27.2 C30.1 C35.1 D1.1(GND) D2.1(GND) D5.2(A) J11.A1(GND_A1) J11.A12(GND_A12) J11.B1(GND_B1) J11.B12(GND_B12) J11.S1(SHIELD) J11.S2(SHIELD) J11.S3(SHIELD) J11.S4(SHIELD) J31.4 Q2.2(Source) Q18.2(Source) Q21.2(Source) R8.1 R18.1 R19.1 R20.1 R55.1 R81.1 R91.1 R96.1 R101.2 R104.1 U4.33(VSS) U16.2(VSS) U19.7(GND) U19.15(EPAD)
P3V3: C2.2 C18.1 C35.2 J31.1 R54.2 R122.2 RT2.2 U4.20(VDD) U19.14(VCC)
P5V: Q1.3,7(Drain2) U16.5(VDD)
USBFS_cVBUS: Q1.6,8(Drain1) R7.2 R10.1 R79.2 R94.1 R100.2
USBFS_cVBUS_CON: D5.1(K) J11.A4(VBUS_A4) J11.A9(VBUS_A9) J11.B4(VBUS_B4) J11.B9(VBUS_B9) R7.1 R95.1
USBHS_cVBUS: R90.2
P407: U19.3(1B) U19.6(2B) ; port P407
P408: U19.8(3B) U19.11(4B) ; port P408
P500: Q2.1(Gate) R55.2 U19.4(2OE) ; port P500
P511/SDA1: R129.2 ; port P511/SDA1
P512/SCL1: R128.2 ; port P512/SCL1
PD07: U19.13(4OE) ; port PD07
RESET_L: J31.3 U4.25(RESET#) ; port RESET_L
USB_FS_CC1: D1.2(NC_1) D1.5(I/O2) J11.A5(CC1) R12.2 U4.16(CC1)
USB_FS_CC2: D1.3(NC_2) D1.4(I/O1) J11.B5(CC2) R17.2 U4.17(CC2)
USBF_N: D2.3(NC_2) D2.4(I/O1) J11.A7(DA-) J11.B7(DB-) R21.2
USBF_P: D2.2(NC_1) D2.5(I/O2) J11.A6(DA+) J11.B6(DB+) R22.2
USBFS_N: FL2.3 ; port USBFS_N
USBFS_P: FL2.2 ; port USBFS_P
USBFS_PD_ANI_CUR: R16.2 U4.4(P22) U16.4(OUT) ; port USBFS_PD_ANI_CUR
USBFS_PD_ANI_THERM: R8.2 RT2.1 U4.3(P21)
USBFS_PD_ATT_UFP: U4.13(P50) U19.5(2A) ; port USBFS_PD_ATT_UFP
USBFS_PD_DISCHG: Q18.1(Gate) R101.1 U4.28(P72) ; port USBFS_PD_DISCHG
USBFS_PD_SRC_DRV: Q21.1(Gate) R104.2 U4.26(P70) ; port USBFS_PD_SRC_DRV
USBFS_PD_TOOL0: J31.2 R122.1 U4.7(P40)
USBFS_R_N: FL2.4 R21.1
USBFS_R_P: FL2.1 R22.1
USBFS_ROLE_SW: U4.24(P137) ; port USBFS_ROLE_SW
USBFS_VBUS_SEL: Q2.3(Drain) R54.1 U19.1(1OE) ; port USBFS_VBUS_SEL
USBHS_PD_ATT_UFP: U19.12(4A) ; port USBHS_PD_ATT_UFP
USBHS_PD_TOOL0: J31.5 ; port USBHS_PD_TOOL0
USBHS_VBUS_SEL: U19.10(3OE) ; port USBHS_VBUS_SEL
NetC26_1: C26.1 Q1.2(Gate1) Q1.5(Gate2) R102.1 R103.2
NetC26_2: C26.2 Q1.1(Source1) Q1.4(Source2) R102.2
NetC27_1: C27.1 U4.19(REGCTX)
NetC30_2: C30.2 U4.21(REGC)
NetQ18_3: Q18.3(Drain) R100.1
NetQ21_3: Q21.3(Drain) R103.1
NetR10_2: R10.2 R18.2 U4.2(P20)
NetR12_1: R12.1 U4.15(RD1)
NetR16_1: R16.1 R94.2 U16.3(IN-)
NetR17_1: R17.1 U4.18(RD2)
NetR19_2: R19.2 U4.23(P122)
NetR20_2: R20.2 U4.22(P121)
NetR79_1: R79.1 R81.2 U19.2(1A)
NetR90_1: R90.1 R91.2 U19.9(3A)
NetR95_2: R95.2 R96.2 U16.1(IN+)
NetR128_1: R128.1 U4.9(P60)
NetR129_1: R129.1 U4.8(P61)

Not connected (* = marked no-connect by the designer): D1 6(VBUS)*; D2 6(VBUS)*; J11 A2(TX1+)* A3(TX1-)* A8(SBU1)* A10(RX2-)* A11(RX2+)* B2(TX2+)* B3(TX2-)* B8(SBU2)* B10(RX1-)* B11(RX1+)*; U4 1(P16)* 5(P31)* 6(P30)* 10(P62)* 11(P32)* 12(P80)* 14(P51)* 27(P71)* 29(P73)* 30(P81)* 31(P82)* 32(P17)*

### Layout directives
differential pair; differential pair class USB: USBF_N, USBF_P, USBFS_N, USBFS_P, USBFS_R_N, USBFS_R_P
net class Power: NetC26_2
net class Power_Control: NetC26_1, NetQ21_3, USBFS_PD_SRC_DRV
net class Power; rule Supply Nets [Voltage = 5.000]: USBFS_cVBUS_CON

### Notes on the sheet
- USB FS Interface
- Place thermistor close to USB-C connector.
- MCU VBUS USB-FS
- MCU VBUS USB-HS
- Note:
  I2C Address: 0x30 (7-bits)
- (near R91) Note:
  For UFP (USB Device) Set P500/PD07 = low
  For DFP (USB Host) Set P500/PD07 = high
  At startup, P500 and PD07 default is low.
- www.renesas.com <http://www.renesas.com>
- Sheet:
- Title:
- Document Number:
- Version:
- Variant:
- Renesas Electronics
- Size:
- A3
- Date:
- Time:
- Page:
- of
- Product Issue:

### Library data of the parts
C2 C26 C35 = CAP-00003203-9: as C61 on sheet Power Supply; Dielectric: X7R; Height: 550µm; Operating Temperature Max: 125°C; Operating Temperature Min: -55°C
C18 C30 = CAP-00000014-5: as C60 on sheet Power Supply; Dielectric: X6S; Height: 600µm; Operating Temperature Max: 105°C; Operating Temperature Min: -55°C
C27 = CAP-00003210-8: Capacitor,EIA0603,4.7u,16V,X7S; Tolerance: 10%; Qualification: AEC-Q200; Subtype: MLCC; Dielectric: X7S; Height: 1mm; Operating Temperature Max: 125°C; Operating Temperature Min: -55°C
D1 D2 = DIO-00003463-14: Low Capacitance TVS Diode Array; Qualification: AEC-Q100; Reverse Voltage: 6.5V; Subtype: ESD; Height: 580µm; Operating Temperature Max: 125°C; Operating Temperature Min: -40°C
D5 = DIO-00000001-5: ESD Suppressor Diode TVS Uni-Dir 22V 55Vc Automotive 2-Pin SGP T/R; Qualification: AEC-Q100; Height: 550µm; Operating Temperature Max: 125°C; Operating Temperature Min: -40°C; Reverse Voltage: 22V; Subtype: ESD
FL2 = IND-00000004-4: Common Mode Choke / Filters, 90uH 25%, 0.1A, 3.8Ohm DCR; Current: 100mA; DC Resistance: 3.8; Frequency: 100MHz; Subtype: CMC; Value: 90; Tolerance: 25%; Height: 450mm; Operating Temperature Max: 85°C; Operating Temperature Min: -40°C; Qualification: -
J11 = CON-00000065-5: Connector USB 3.2 Gen2 Type C Horizontal SMD; Gender: female; Current: 5A; Operating Voltage Max: 20V; Pin Count: 24; Operating Temperature Max: 85°C; Qualification: -; Operating Temperature Min: -40°C; Height: 3.43mm
J31 = CON-00003286-13: Header,5way,1row,vertical,2.54mm,THT; Current: 3A; DC Resistance: 20m; Gender: male; Operating Voltage Max: 250V; Height: 8.89mm; Operating Temperature Max: 105°C; Operating Temperature Min: -40°C; Pin Count: 5; Qualification: -; DNF: DNF
Q1 = TRA-00000003-7: Dual P-Channel -12V -4.5A MOSFET; DC Resistance: 0.11; Gate Voltage Threshold Max: -1V; Gate Voltage Threshold Min: -400mV; Input Capacitance: 1.5nF; Power: 1.9W; Subtype: PMOS; Current: -4.5A; Operating Temperature Max: 150°C; Operating Temperature Min: -55°C; Operating Voltage Max: -12V; Pin Count: 6; Qualification: -
Q2 Q21 = TRA-00000001-2: N-Channel 60V 250mA Small Signal MOSFET; DC Resistance: 2.4; Gate Voltage Threshold Max: 2.3V; Gate Voltage Threshold Min: 1V; Input Capacitance: 15pF; Power: 150mW; Subtype: NMOS; Current: 250mA; Operating Temperature Max: 150°C; Operating Temperature Min: -55°C; Operating Voltage Max: 60V; Pin Count: 3; Qualification: -
Q18 = TRA-00000004-3: N-Channel 30V 5A 1.3W MOSFET; DC Resistance: 29m; Gate Voltage Threshold Max: 1.1V; Gate Voltage Threshold Min: 500mV; Input Capacitance: 650pF; Subtype: NMOS; Current: 5A; Operating Temperature Max: 150°C; Operating Temperature Min: -55°C; Operating Voltage Max: 30V; Pin Count: 3; Power: 1.3W; Qualification: -
R7 = RES-00003205-3: Resistor,EIA0603,10m,0.25W; Power: 250mW; Qualification: AEC-Q200; Subtype: Chip Resistor; Height: 700µm; Operating Temperature Max: 125°C; Operating Temperature Min: -55°C
R8 = RES-00001689-10: Resistor,EIA0402,16.2k,0.0625W; Power: 62.5mW; Tolerance: 1%; Subtype: Chip Resistor; Operating Temperature Max: 155°C; Operating Temperature Min: -55°C; Qualification: -
R10 R16 R55 R96 R101 R104 = RES-00000926-9: Resistor,EIA0402,100k,0.0625W; Power: 62.5mW; Tolerance: 1%; Subtype: Chip Resistor; Operating Temperature Max: 155°C; Operating Temperature Min: -55°C; Qualification: -
R12 R17 = RES-00000895-9: Resistor,EIA0402,5.1k,0.0625W; Power: 62.5mW; Tolerance: 1%; Subtype: Chip Resistor; Operating Temperature Max: 155°C; Operating Temperature Min: -55°C; Qualification: -
R18 R79 R90 = RES-00000906-9: Resistor,EIA0402,15k,0.0625W; Tolerance: 1%; Power: 62.5mW; Subtype: Chip Resistor; Operating Temperature Min: -55°C; Qualification: -; Operating Temperature Max: 155°C
R19 R20 R128 R129 = RES-00000801-9: as R13 on sheet HMI Features; Operating Temperature Max: 155°C; Operating Temperature Min: -55°C; Qualification: -
R21 R22 = RES-00000840-9: Resistor,EIA0402,27,0.0625W; Power: 62.5mW; Tolerance: 1%; Subtype: Chip Resistor; Operating Temperature Max: 155°C; Operating Temperature Min: -55°C; Qualification: -
R54 R103 = RES-00000894-9: as R38 on sheet HMI Features; Operating Temperature Max: 155°C; Operating Temperature Min: -55°C; Qualification: -
R81 R91 = RES-00000913-9: Resistor,EIA0402,30k,0.0625W; Subtype: Chip Resistor; Tolerance: 1%; Power: 62.5mW; Qualification: -; Operating Temperature Min: -55°C; Operating Temperature Max: 155°C
R94 R95 = RES-00000902-9: as R36 on sheet Power Supply; Operating Temperature Max: 155°C; Operating Temperature Min: -55°C; Qualification: -
R100 = RES-00003204-2: Resistor,EIA2512,220,1W; Tolerance: 1%; Operating Voltage Max: 200V; Qualification: AEC-Q100; Subtype: Chip Resistor; Height: 750µm; Operating Temperature Max: 155°C; Operating Temperature Min: -55°C; Temperature Coefficient: -
R102 = RES-00000918-9: as R31 on sheet HMI Features; Operating Temperature Max: 155°C; Operating Temperature Min: -55°C; Qualification: -
R122 = RES-00000878-9: as R24 on sheet Power Supply; Operating Temperature Max: 155°C; Operating Temperature Min: -55°C; Qualification: -
RT2 = RES-00000000-6: NTC Thermistor, R_EIA0402, 100K, 4250K; Operating Voltage Max: 5V; Power: 160µW; Height: 550µm; Operating Temperature Max: 125°C; Operating Temperature Min: -40°C; Qualification: -; Subtype: Thermistor
U4 = ICS-00000018-7: USB Power Delivery Controller, USB 3.1, HVQFN32; Frequency: 24MHz; Operating Voltage Max: 5.5V; Operating Voltage Min: 3V; Output Voltage Min: 0V; Subtype: Digital; Operating Temperature Max: 105°C; Operating Temperature Min: -40°C; Output Voltage Max: 5.5V; Pin Count: 33; Qualification: -
U16 = ICS-00000015-3: Single, General Purpose Micropower, RRIO Operational Amplifier; Frequency: 2MHz; Operating Voltage Max: 5.5V; Operating Voltage Min: 1.8V; Subtype: Power; Operating Temperature Max: 125°C; Operating Temperature Min: -40°C; Output Voltage Max: 5.5V; Pin Count: 5; Qualification: -
U19 = ICS-00000034-10: Bus Driver, 4-Func, 1-Bit, True Output, CMOS, DHVQN14, SOT762-1; Frequency: 406MHz; Subtype: Digital; Current: 100mA; Power: 500mW; Operating Voltage Min: 2.3V; Operating Voltage Max: 3.6V; Pin Count: 15; Operating Temperature Min: -40°C; Qualification: -; Operating Temperature Max: 125°C

## Sheet Arduino Shield Connection.SchDoc
size A3; Company Name: Renesas Electronics America; CompanyURL: www.renesas.com; PageSetup: Record=PageOptions|CenterHorizontal=True|CenterVertical=True|PrintScale=1.00|XCorrection=1.00|YCorrection=1.00|PrintKind=1|BorderSize=5000000|LeftOffset=0|BottomOffset=0|Orientation=2|PaperLength=1000|PaperWidth=1000|Scale=100|PaperSource=7|PrintQuality=-4|MediaType=1|DitherType=10|PaperKind=A5 148x210mm|PrintScaleMode=1; ReleaseDate: 16.09.2025; Version: MP; SheetNumber: 5; SheetTotal: 18; VariantNumber: 0; DSheetNumber: 1
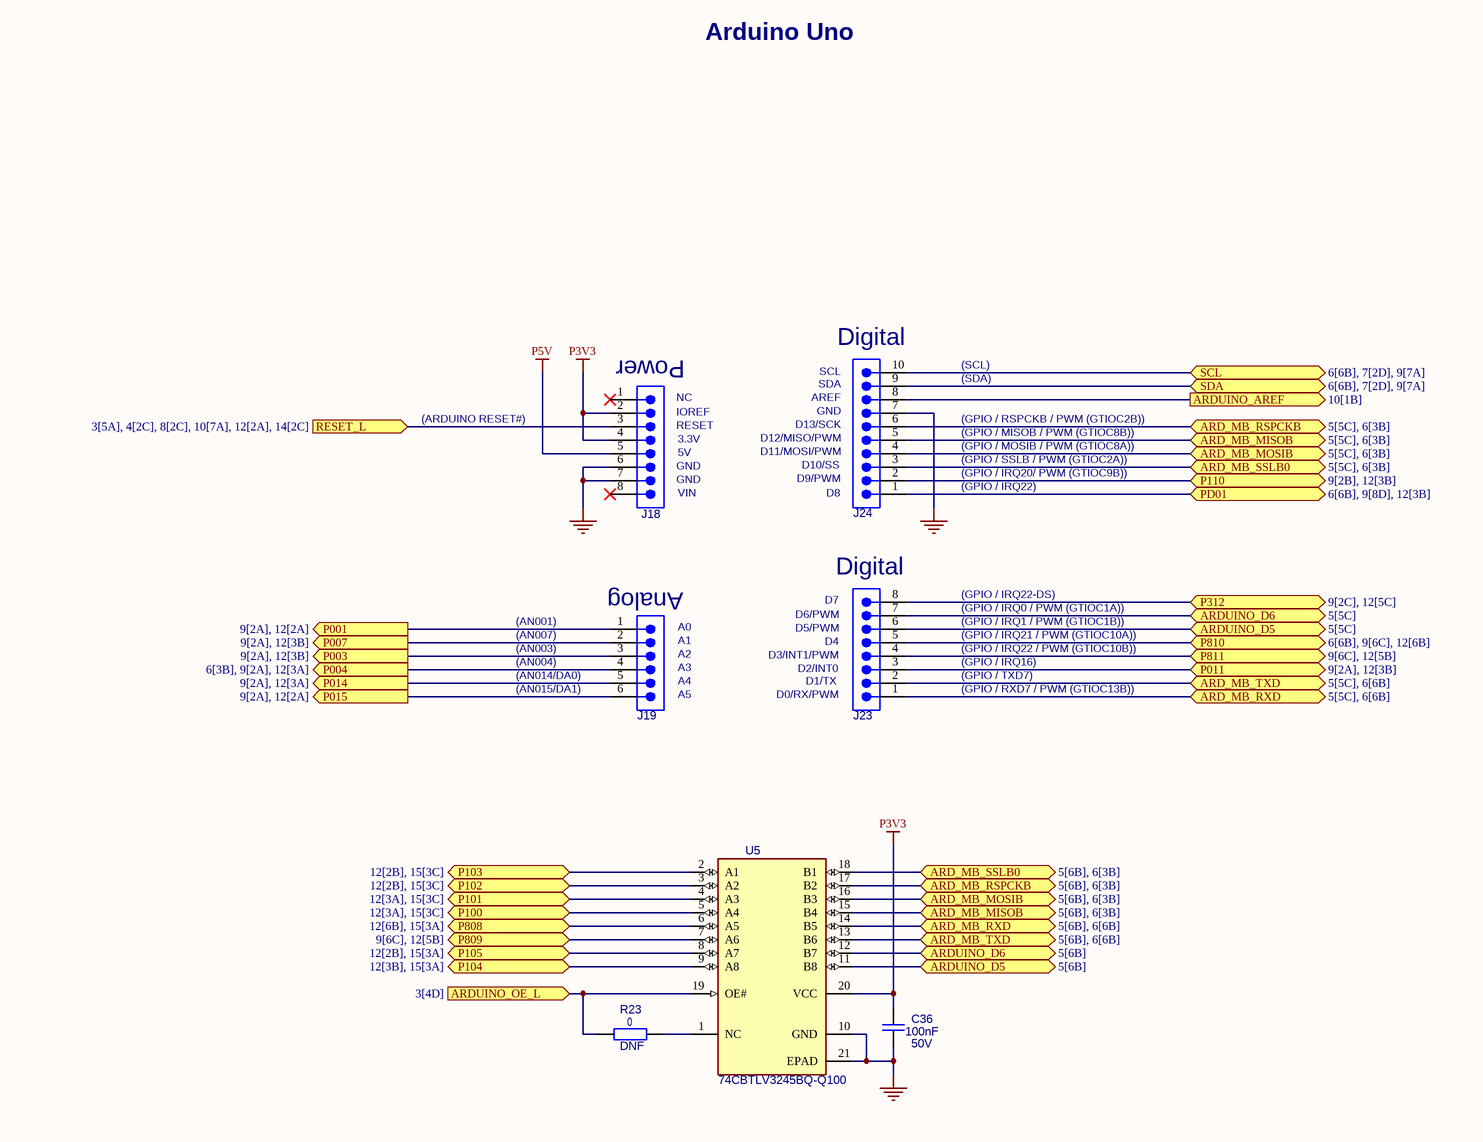
[diagram p4: Arduino Shield Connection.SchDoc]

### Parts
C36  value 100nF  Operating Voltage Max: 50V  [C_EIA0402_0p55]  (hidden comment: Capacitor)
J18  NPTC081KFXC-RC  [sul_NPTC081KFXC-RC]  (value not drawn)
J19  NPTC061KFXC-RC  [sul_NPTC061KFXC-RC]  (value not drawn)
J23  NPTC081KFXC-RC  [sul_NPTC081KFXC-RC]  (value not drawn)
J24  NPTC101KFXC-RC  [sul_NPTC101KFXC-RC]  (value not drawn)
R23  value 0  [R_EIA0402]  (hidden comment: Resistor)
U5  74CBTLV3245BQ-Q100  [nex_SOT-764-1_DHVQFN20]

### Ports
ARD_MB_MISOB (bidir, see 5[5C], 6[3B]), ARD_MB_MISOB (bidir, see 5[6B], 6[3B]), ARD_MB_MOSIB (bidir, see 5[5C], 6[3B]), ARD_MB_MOSIB (bidir, see 5[6B], 6[3B]), ARD_MB_RSPCKB (bidir, see 5[5C], 6[3B]), ARD_MB_RSPCKB (bidir, see 5[6B], 6[3B]), ARD_MB_RXD (bidir, see 5[5C], 6[6B]), ARD_MB_RXD (bidir, see 5[6B], 6[6B]), ARD_MB_SSLB0 (bidir, see 5[5C], 6[3B]), ARD_MB_SSLB0 (bidir, see 5[6B], 6[3B]), ARD_MB_TXD (bidir, see 5[5C], 6[6B]), ARD_MB_TXD (bidir, see 5[6B], 6[6B]), ARDUINO_AREF (out, see 10[1B]), ARDUINO_D5 (bidir, see 5[5C]), ARDUINO_D5 (bidir, see 5[6B]), ARDUINO_D6 (bidir, see 5[5C]), ARDUINO_D6 (bidir, see 5[6B]), ARDUINO_OE_L (in, see 3[4D]), P001 (out, see 9[2A], 12[2A]), P003 (out, see 9[2A], 12[3B]), P004 (out, see 6[3B], 9[2A], 12[3A]), P007 (out, see 9[2A], 12[3B]), P011 (bidir, see 9[2A], 12[3B]), P014 (out, see 9[2A], 12[3A]), P015 (out, see 9[2A], 12[2A]), P100 (bidir, see 12[3A], 15[3C]), P101 (bidir, see 12[3A], 15[3C]), P102 (bidir, see 12[2B], 15[3C]), P103 (bidir, see 12[2B], 15[3C]), P104 (bidir, see 12[3B], 15[3A]), P105 (bidir, see 12[2B], 15[3A]), P110 (bidir, see 9[2B], 12[3B]), P312 (bidir, see 9[2C], 12[5C]), P808 (bidir, see 12[6B], 15[3A]), P809 (bidir, see 9[6C], 12[5B]), P810 (bidir, see 6[6B], 9[6C], 12[6B]), P811 (bidir, see 9[6C], 12[5B]), PD01 (bidir, see 6[6B], 9[8D], 12[3B]), RESET_L (in, see 3[5A], 4[2C], 8[2C], 10[7A], 12[2A], 14[2C]), SCL (bidir, see 6[6B], 7[2D], 9[7A]), SDA (bidir, see 6[6B], 7[2D], 9[7A])

### Nets
GND: C36.1 J18.6 J18.7 J24.7 U5.10(GND) U5.21(EPAD)
P3V3: C36.2 J18.2 J18.4 U5.20(VCC)
P5V: J18.5
ARD_MB_MISOB: J24.5 U5.15(B4) ; port ARD_MB_MISOB
ARD_MB_MOSIB: J24.4 U5.16(B3) ; port ARD_MB_MOSIB
ARD_MB_RSPCKB: J24.6 U5.17(B2) ; port ARD_MB_RSPCKB
ARD_MB_RXD: J23.1 U5.14(B5) ; port ARD_MB_RXD
ARD_MB_SSLB0: J24.3 U5.18(B1) ; port ARD_MB_SSLB0
ARD_MB_TXD: J23.2 U5.13(B6) ; port ARD_MB_TXD
ARDUINO_AREF: J24.8 ; port ARDUINO_AREF
ARDUINO_D5: J23.6 U5.11(B8) ; port ARDUINO_D5
ARDUINO_D6: J23.7 U5.12(B7) ; port ARDUINO_D6
ARDUINO_OE_L: R23.1 U5.19(OE#) ; port ARDUINO_OE_L
P001: J19.1 ; port P001
P003: J19.3 ; port P003
P004: J19.4 ; port P004
P007: J19.2 ; port P007
P011: J23.3 ; port P011
P014: J19.5 ; port P014
P015: J19.6 ; port P015
P100: U5.5(A4) ; port P100
P101: U5.4(A3) ; port P101
P102: U5.3(A2) ; port P102
P103: U5.2(A1) ; port P103
P104: U5.9(A8) ; port P104
P105: U5.8(A7) ; port P105
P110: J24.2 ; port P110
P312: J23.8 ; port P312
P808: U5.6(A5) ; port P808
P809: U5.7(A6) ; port P809
P810: J23.5 ; port P810
P811: J23.4 ; port P811
PD01: J24.1 ; port PD01
RESET_L: J18.3 ; port RESET_L
SCL: J24.10 ; port SCL
SDA: J24.9 ; port SDA
NetR23_2: R23.2 U5.1(NC)

Not connected (* = marked no-connect by the designer): J18 1* 8*

### Notes on the sheet
- Arduino Uno
- (near J18) Power
- (near J24) Digital
- (ARDUINO RESET#)
- (near J18) NC
- (near J18) IOREF
- (near J18) RESET
- (near J24) D13/SCK
- (near J24) AREF
- (near J24) GND
- (near J24) SDA
- (near J24) SCL
- (SCL)
- (SDA)
- (GPIO / RSPCKB / PWM (GTIOC2B))
- (near J18) GND
- (near J18) 3.3V
- (near J18) 5V
- D12/MISO/PWM
- D11/MOSI/PWM
- (near J24) D9/PWM
- (near J24) D10/SS
- (GPIO / MISOB / PWM (GTIOC8B))
- (GPIO / MOSIB / PWM (GTIOC8A))
- (GPIO / SSLB / PWM (GTIOC2A))
- (GPIO / IRQ20/ PWM (GTIOC9B))
- (GPIO / IRQ22)
- (near J18) VIN
- (near J24) D8
- (AN001)
- (near J19) A0
- (near J19) Analog
- (near J23) D6/PWM
- (near J23) D7
- (near J23) Digital
- (GPIO / IRQ0 / PWM (GTIOC1A))
- (GPIO / IRQ1 / PWM (GTIOC1B))
- (GPIO / IRQ22-DS)
- (AN007)
- (AN015/DA1)
- (AN014/DA0)
- (AN004)
- (AN003)
- (near J19) A1
- (near J19) A5
- (near J19) A4
- (near J19) A3
- (near J19) A2
- (near J23) D3/INT1/PWM
- D0/RX/PWM
- (near J23) D5/PWM
- (near J23) D2/INT0
- (near J23) D1/TX
- (near J23) D4
- (GPIO / RXD7 / PWM (GTIOC13B))
- (GPIO / TXD7)
- (GPIO / IRQ21 / PWM (GTIOC10A))
- (GPIO / IRQ22 / PWM (GTIOC10B))
- (GPIO / IRQ16)
- www.renesas.com <http://www.renesas.com>
- Sheet:
- Title:
- Document Number:
- Version:
- Variant:
- Renesas Electronics
- Size:
- Date:
- Time:
- Page:
- of
- Product Issue:

### Library data of the parts
C36 = CAP-00003203-9: as C61 on sheet Power Supply; Dielectric: X7R; Height: 550µm; Operating Temperature Max: 125°C; Operating Temperature Min: -55°C
J18 J23 = CON-00000044-4: Header, 8way, 1 Row, Vertical, 2.54mm, SMD; Current: 3A; Gender: female; Operating Voltage Max: 500V; Height: 7.75mm; Operating Temperature Min: -40°C; Qualification: -; Pin Count: 8; Operating Temperature Max: 125°C
J19 = CON-00000043-4: Header, 6way, 1 Row, Vertical, 2.54mm, SMD; Current: 3A; Operating Voltage Max: 500V; Gender: female; Operating Temperature Max: 125°C; Qualification: -; Height: 7.75mm; Operating Temperature Min: -40°C; Pin Count: 6
J24 = CON-00000045-4: Header, 10way, 1 Row, Vertical, 2.54mm, SMD; Operating Voltage Max: 500V; Current: 3A; Gender: female; Qualification: -; Operating Temperature Max: 125°C; Height: 7.75mm; Pin Count: 10; Operating Temperature Min: -40°C
R23 = RES-00000801-9: as R13 on sheet HMI Features; Operating Temperature Max: 155°C; Operating Temperature Min: -55°C; Qualification: -; DNF: DNF
U5 = ICS-00000017-5: Octal FET Bus Switch, 5 ohm, 0.3ns max delay, DHVQFN20; Current: 128mA; Operating Voltage Max: 3.6V; Operating Voltage Min: 2.3V; Output Voltage Min: 0V; Qualification: AEC-Q100; Operating Temperature Max: 125°C; Operating Temperature Min: -40°C; Output Voltage Max: 3.6V; Pin Count: 21; Subtype: Bus Switch

## Sheet mikroBUS Connection.SchDoc
size A3; Company Name: Renesas Electronics America; CompanyURL: www.renesas.com; PageSetup: Record=PageOptions|CenterHorizontal=True|CenterVertical=True|PrintScale=1.00|XCorrection=1.00|YCorrection=1.00|PrintKind=1|BorderSize=5000000|LeftOffset=0|BottomOffset=0|Orientation=2|PaperLength=1000|PaperWidth=1000|Scale=100|PaperSource=7|PrintQuality=-4|MediaType=1|DitherType=10|PaperKind=A5 148x210mm|PrintScaleMode=1; ReleaseDate: 16.09.2025; Version: MP; SheetNumber: 6; SheetTotal: 18; VariantNumber: 0; DSheetNumber: 1
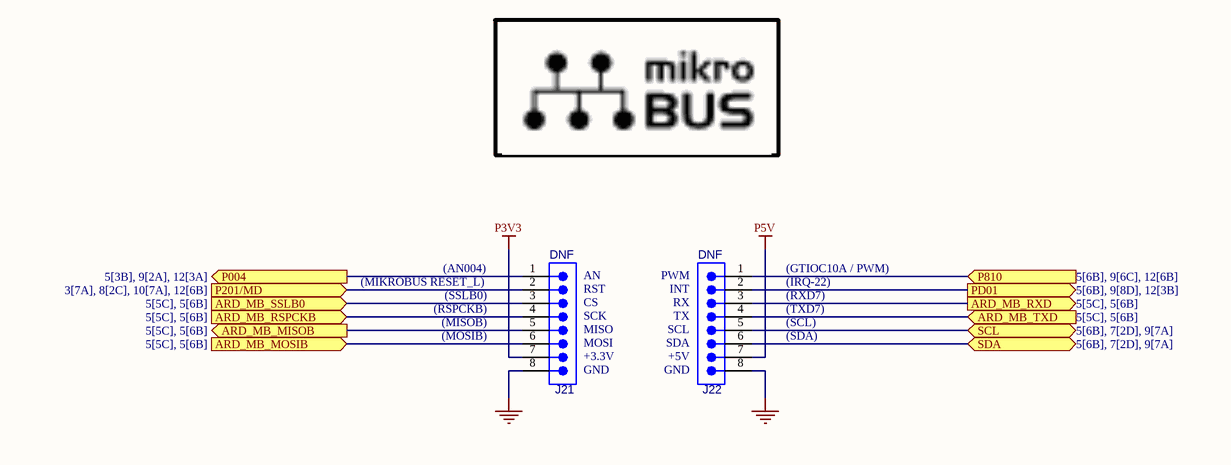
[diagram p5: mikroBUS Connection.SchDoc]

### Parts
J21  CES-108-01-T-S  [sam_CES-108-01-T-S]  (value not drawn)
J22  CES-108-01-T-S  [sam_CES-108-01-T-S]  (value not drawn)
X?  Icon-mikroBUS  [ICON-MIKROBUS]  (value not drawn)  (graphical)

### Ports
ARD_MB_MISOB (out, see 5[5C], 5[6B]), ARD_MB_MOSIB (in, see 5[5C], 5[6B]), ARD_MB_RSPCKB (in, see 5[5C], 5[6B]), ARD_MB_RXD (out, see 5[5C], 5[6B]), ARD_MB_SSLB0 (in, see 5[5C], 5[6B]), ARD_MB_TXD (in, see 5[5C], 5[6B]), P004 (out, see 5[3B], 9[2A], 12[3A]), P201/MD (in, see 3[7A], 8[2C], 10[7A], 12[6B]), P810 (in, see 5[6B], 9[6C], 12[6B]), PD01 (out, see 5[6B], 9[8D], 12[3B]), SCL (bidir, see 5[6B], 7[2D], 9[7A]), SDA (bidir, see 5[6B], 7[2D], 9[7A])

### Nets
GND: J21.8 J22.8
P3V3: J21.7
P5V: J22.7
ARD_MB_MISOB: J21.5 ; port ARD_MB_MISOB
ARD_MB_MOSIB: J21.6 ; port ARD_MB_MOSIB
ARD_MB_RSPCKB: J21.4 ; port ARD_MB_RSPCKB
ARD_MB_RXD: J22.3 ; port ARD_MB_RXD
ARD_MB_SSLB0: J21.3 ; port ARD_MB_SSLB0
ARD_MB_TXD: J22.4 ; port ARD_MB_TXD
P004: J21.1 ; port P004
P201/MD: J21.2 ; port P201/MD
P810: J22.1 ; port P810
PD01: J22.2 ; port PD01
SCL: J22.5 ; port SCL
SDA: J22.6 ; port SDA

### Notes on the sheet
- (MIKROBUS RESET_L)
- (AN004)
- (near J21) AN
- (near J21) RST
- (near J22) PWM
- (near J22) INT
- (IRQ-22)
- (GTIOC10A / PWM)
- (RSPCKB)
- (MOSIB)
- (MISOB)
- (SSLB0)
- (near J21) MOSI
- (near J21) MISO
- (near J21) CS
- (near J21) SCK
- (near J22) SDA
- (near J22) SCL
- (near J22) RX
- (near J22) TX
- (SCL)
- (SDA)
- (RXD7)
- (TXD7)
- (near J21) GND
- (near J21) +3.3V
- (near J22) GND
- (near J22) +5V
- www.renesas.com <http://www.renesas.com>
- Sheet:
- Title:
- Document Number:
- Version:
- Variant:
- Renesas Electronics
- Size:
- A3
- Date:
- Time:
- Page:
- of
- Product Issue:

### Library data of the parts
J21 J22 = CON-00000111-3: Socket,8way,1row,vertical,2.54mm,THT; Operating Voltage Max: 400V; Current: 5.5A; Gender: female; DC Resistance: 10m; Operating Temperature Min: -55°C; Height: 8.35mm; Qualification: -; Operating Temperature Max: 105°C; Pin Count: 8; DNF: DNF
X? = ICON-000001-01: mikroBUS footprint silkscreen